# Altium project higgs.PrjPCB (part 4 of 7)

## Sheet tie-il34-il07.SchDoc: CS - Net Tie 34:07
size Letter; CheckedBy: J. Brinton; CompanyName: Signal Laboratories, Inc.; DrawnBy: J. Brinton; Engineer: J. Brinton; Address1: 3479 Edison Way; Address2: Menlo Park CA 94025; Address3: +1 (877) 778-8435; Address4: siglabs.com; Revision: 3; SheetNumber: 28; SheetTotal: 47
Used 4 times, as channels MAIN/ARRAY/TIE-IL34_20-IL07_30, MAIN/ARRAY/TIE-IL34_21-IL07_31, MAIN/ARRAY/TIE-IL34_22-IL07_32, MAIN/ARRAY/TIE-IL34_23-IL07_33. Parts and nets are listed once, with the designators drawn on the sheet.
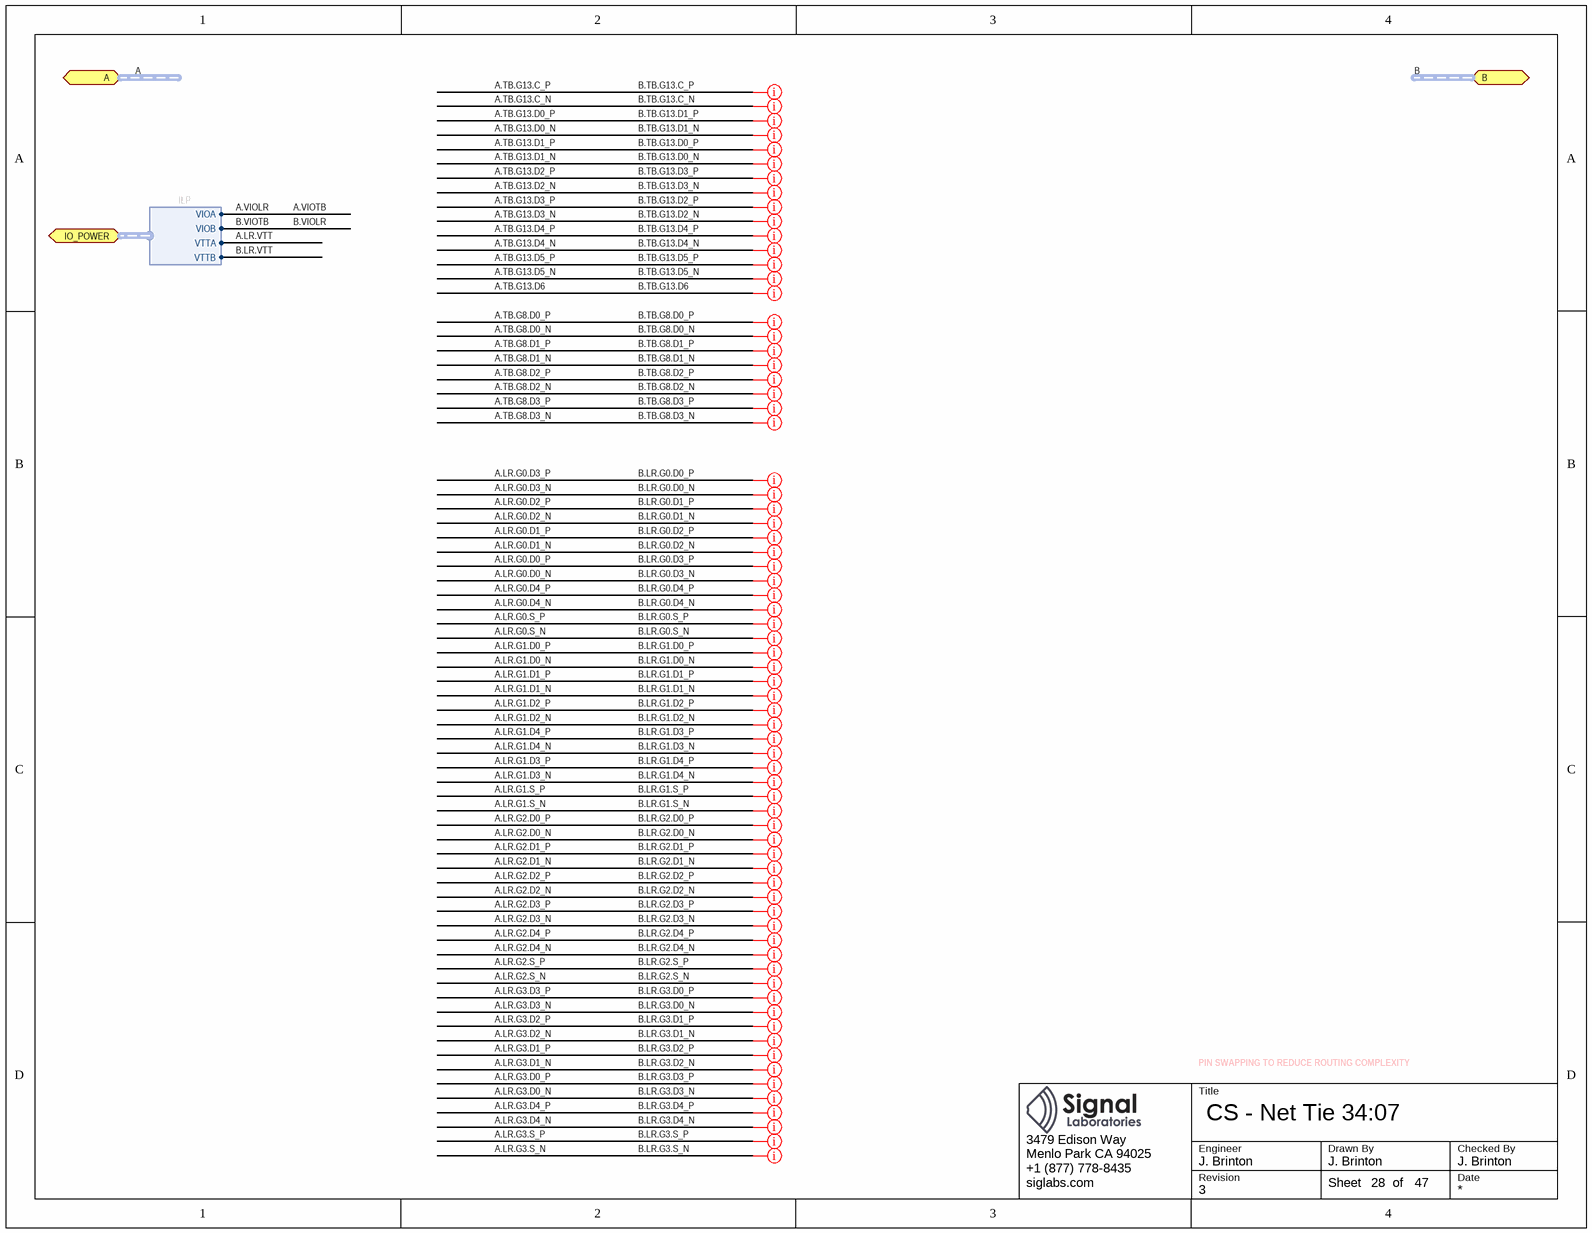
[diagram p19: tie-il34-il07.SchDoc]

### Ports
A (harness IL), B (harness IL), IO_POWER (harness ILP)

### Harnesses
ILP: VIOA, VIOB, VTTA, VTTB

### Channels
MAIN/ARRAY/TIE-IL34_20-IL07_30: no parts or ports
MAIN/ARRAY/TIE-IL34_21-IL07_31: no parts or ports
MAIN/ARRAY/TIE-IL34_22-IL07_32: no parts or ports
MAIN/ARRAY/TIE-IL34_23-IL07_33: no parts or ports

### Buses and harness runs
harness A = port A
harness B = port B

### Layout directives
net class z50: A.TB.G13.D6_TIE-IL34_20-IL07_30
net class z50; differential pair; net class loose: A.LR.G0.D0_N_TIE-IL34_20-IL07_30, A.LR.G0.D0_P_TIE-IL34_20-IL07_30, A.LR.G0.D1_N_TIE-IL34_20-IL07_30, A.LR.G0.D1_P_TIE-IL34_20-IL07_30, A.LR.G0.D2_N_TIE-IL34_20-IL07_30, A.LR.G0.D2_P_TIE-IL34_20-IL07_30, A.LR.G0.D3_N_TIE-IL34_20-IL07_30, A.LR.G0.D3_P_TIE-IL34_20-IL07_30, A.LR.G0.D4_N_TIE-IL34_20-IL07_30, A.LR.G0.D4_P_TIE-IL34_20-IL07_30, A.LR.G0.S_N_TIE-IL34_20-IL07_30, A.LR.G0.S_P_TIE-IL34_20-IL07_30, A.LR.G1.D0_N_TIE-IL34_20-IL07_30, A.LR.G1.D0_P_TIE-IL34_20-IL07_30, A.LR.G1.D1_N_TIE-IL34_20-IL07_30, A.LR.G1.D1_P_TIE-IL34_20-IL07_30, A.LR.G1.D2_N_TIE-IL34_20-IL07_30, A.LR.G1.D2_P_TIE-IL34_20-IL07_30, A.LR.G1.D3_N_TIE-IL34_20-IL07_30, A.LR.G1.D3_P_TIE-IL34_20-IL07_30, A.LR.G1.D4_N_TIE-IL34_20-IL07_30, A.LR.G1.D4_P_TIE-IL34_20-IL07_30, A.LR.G1.S_N_TIE-IL34_20-IL07_30, A.LR.G1.S_P_TIE-IL34_20-IL07_30, A.LR.G2.D0_N_TIE-IL34_20-IL07_30, A.LR.G2.D0_P_TIE-IL34_20-IL07_30, A.LR.G2.D1_N_TIE-IL34_20-IL07_30, A.LR.G2.D1_P_TIE-IL34_20-IL07_30, A.LR.G2.D2_N_TIE-IL34_20-IL07_30, A.LR.G2.D2_P_TIE-IL34_20-IL07_30, A.LR.G2.D3_N_TIE-IL34_20-IL07_30, A.LR.G2.D3_P_TIE-IL34_20-IL07_30, A.LR.G2.D4_N_TIE-IL34_20-IL07_30, A.LR.G2.D4_P_TIE-IL34_20-IL07_30, A.LR.G2.S_N_TIE-IL34_20-IL07_30, A.LR.G2.S_P_TIE-IL34_20-IL07_30, A.LR.G3.D0_N_TIE-IL34_20-IL07_30, A.LR.G3.D0_P_TIE-IL34_20-IL07_30, A.LR.G3.D1_N_TIE-IL34_20-IL07_30, A.LR.G3.D1_P_TIE-IL34_20-IL07_30, A.LR.G3.D2_N_TIE-IL34_20-IL07_30, A.LR.G3.D2_P_TIE-IL34_20-IL07_30, A.LR.G3.D3_N_TIE-IL34_20-IL07_30, A.LR.G3.D3_P_TIE-IL34_20-IL07_30, A.LR.G3.D4_N_TIE-IL34_20-IL07_30, A.LR.G3.D4_P_TIE-IL34_20-IL07_30, A.LR.G3.S_N_TIE-IL34_20-IL07_30, A.LR.G3.S_P_TIE-IL34_20-IL07_30, A.TB.G8.D0_N_TIE-IL34_20-IL07_30, A.TB.G8.D0_P_TIE-IL34_20-IL07_30, A.TB.G8.D1_N_TIE-IL34_20-IL07_30, A.TB.G8.D1_P_TIE-IL34_20-IL07_30, A.TB.G8.D2_N_TIE-IL34_20-IL07_30, A.TB.G8.D2_P_TIE-IL34_20-IL07_30, A.TB.G8.D3_N_TIE-IL34_20-IL07_30, A.TB.G8.D3_P_TIE-IL34_20-IL07_30, A.TB.G13.C_N_TIE-IL34_20-IL07_30, A.TB.G13.C_P_TIE-IL34_20-IL07_30, A.TB.G13.D0_N_TIE-IL34_20-IL07_30, A.TB.G13.D0_P_TIE-IL34_20-IL07_30, A.TB.G13.D1_N_TIE-IL34_20-IL07_30, A.TB.G13.D1_P_TIE-IL34_20-IL07_30, A.TB.G13.D2_N_TIE-IL34_20-IL07_30, A.TB.G13.D2_P_TIE-IL34_20-IL07_30, A.TB.G13.D3_N_TIE-IL34_20-IL07_30, A.TB.G13.D3_P_TIE-IL34_20-IL07_30, A.TB.G13.D4_N_TIE-IL34_20-IL07_30, A.TB.G13.D4_P_TIE-IL34_20-IL07_30, A.TB.G13.D5_N_TIE-IL34_20-IL07_30, A.TB.G13.D5_P_TIE-IL34_20-IL07_30

### Notes on the sheet
- PIN SWAPPING TO REDUCE ROUTING COMPLEXITY
- Title
- Engineer
- Revision
- Drawn By
- Checked By
- Date
- Sheet
- of

## Sheet clock.SchDoc: CS - Clock Fanout
size Letter; CheckedBy: J. Brinton; CompanyName: Signal Laboratories, Inc.; DrawnBy: J. Brinton; Engineer: J. Brinton; Address1: 3479 Edison Way; Address2: Menlo Park CA 94025; Address3: +1 (877) 778-8435; Address4: siglabs.com; Revision: 3; SheetNumber: 37; SheetTotal: 47
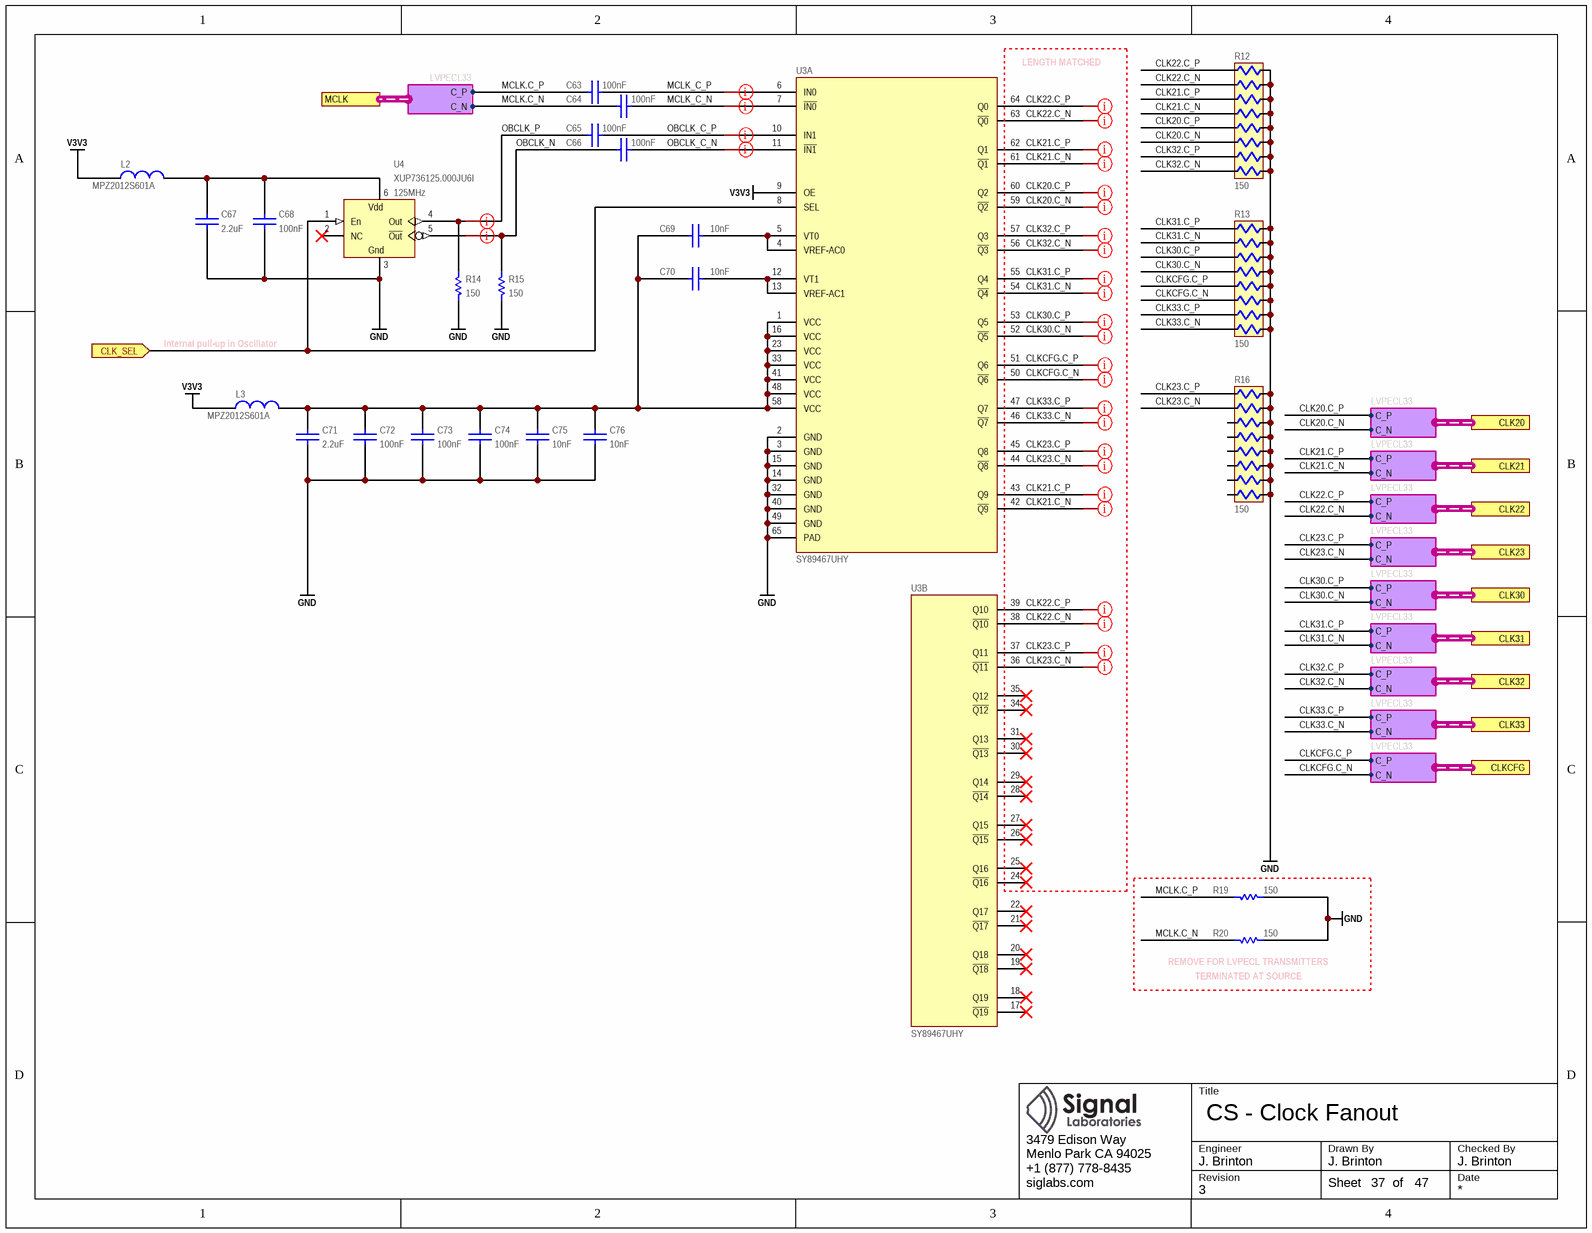
[diagram p20: clock.SchDoc]

### Parts
C63  value 100nF  [CAPC100X50X55L25N]  (hidden comment: GCM155R71H104KE02)
C64  value 100nF  [CAPC100X50X55L25N]  (hidden comment: GCM155R71H104KE02)
C65  value 100nF  [CAPC100X50X55L25N]  (hidden comment: GCM155R71H104KE02)
C66  value 100nF  [CAPC100X50X55L25N]  (hidden comment: GCM155R71H104KE02)
C67  value 2.2uF  [CAPC160X80X90L20N]  (hidden comment: C1608X7R1A225M080)
C68  value 100nF  [CAPC100X50X55L25N]  (hidden comment: GCM155R71H104KE02)
C69  value 10nF  [CAPC100X50X55L25N]  (hidden comment: GRM155R71H103KA88)
C70  value 10nF  [CAPC100X50X55L25N]  (hidden comment: GRM155R71H103KA88)
C71  value 2.2uF  [CAPC160X80X90L20N]  (hidden comment: C1608X7R1A225M080)
C72  value 100nF  [CAPC100X50X55L25N]  (hidden comment: GCM155R71H104KE02)
C73  value 100nF  [CAPC100X50X55L25N]  (hidden comment: GCM155R71H104KE02)
C74  value 100nF  [CAPC100X50X55L25N]  (hidden comment: GCM155R71H104KE02)
C75  value 10nF  [CAPC100X50X55L25N]  (hidden comment: GRM155R71H103KA88)
C76  value 10nF  [CAPC100X50X55L25N]  (hidden comment: GRM155R71H103KA88)
L2  MPZ2012S601A  [0805]
L3  MPZ2012S601A  [0805]
R12  value 150  [RESCAXE16P50_380X160X55L30X35N]  (hidden comment: EXB-2HV151JV)
R13  value 150  [RESCAXE16P50_380X160X55L30X35N]  (hidden comment: EXB-2HV151JV)
R14  value 150  [RESC1005X40N]  (hidden comment: ERJ-2RKF1500X)
R15  value 150  [RESC1005X40N]  (hidden comment: ERJ-2RKF1500X)
R16  value 150  [RESCAXE16P50_380X160X55L30X35N]  (hidden comment: EXB-2HV151JV)
R19  value 150  [RESC1005X40N]  (hidden comment: ERJ-2RKF1500X)
R20  value 150  [RESC1005X40N]  (hidden comment: ERJ-2RKF1500X)
U3  SY89467UHY  [QFP65P50_1200X1200X120L60X22T500N]  (parts A,B of 2)
U4  value 125MHz  [OSCSC6P254_735X505X140L110X140]  (hidden comment: XUP736125.000JU6I)

### Ports
CLK20 (harness LVPECL33), CLK21 (harness LVPECL33), CLK22 (harness LVPECL33), CLK23 (harness LVPECL33), CLK30 (harness LVPECL33), CLK31 (harness LVPECL33), CLK32 (harness LVPECL33), CLK33 (harness LVPECL33), CLK_SEL (in), CLKCFG (harness LVPECL33), MCLK (harness LVPECL33)

### Harnesses
LVPECL33: C_P, C_N

### Nets
GND: C67.1 C68.1 C71.1 C72.1 C73.1 C74.1 C75.2 C76.2 R12.9 R12.10 R12.11 R12.12 R12.13 R12.14 R12.15 R12.16 R13.9 R13.10 R13.11 R13.12 R13.13 R13.14 R13.15 R13.16 R14.1 R15.1 R16.9 R16.10 R16.11 R16.12 R16.13 R16.14 R16.15 R16.16 R19.2 R20.2 U3.2(GND) U3.3(GND) U3.14(GND) U3.15(GND) U3.32(GND) U3.40(GND) U3.49(GND) U3.65(PAD) U4.3(GND)
V3V3: L2.2 L3.2 U3.9(OE)
CLK20.C_N: R12.6 U3.59(~{Q2}) ; port CLK20.C_N  [project net CLK.C_N]
CLK20.C_P: R12.5 U3.60(Q2) ; port CLK20.C_P  [project net CLK.C_P]
CLK21.C_N: R12.4 U3.42(~{Q9}) U3.61(~{Q1}) ; port CLK21.C_N  [project net CLK.C_N]
CLK21.C_P: R12.3 U3.43(Q9) U3.62(Q1) ; port CLK21.C_P  [project net CLK.C_P]
CLK22.C_N: R12.2 U3.38(~{Q10}) U3.63(~{Q0}) ; port CLK22.C_N  [project net CLK.C_N]
CLK22.C_P: R12.1 U3.39(Q10) U3.64(Q0) ; port CLK22.C_P  [project net CLK.C_P]
CLK23.C_N: R16.2 U3.36(~{Q11}) U3.44(~{Q8}) ; port CLK23.C_N  [project net CLK.C_N]
CLK23.C_P: R16.1 U3.37(Q11) U3.45(Q8) ; port CLK23.C_P  [project net CLK.C_P]
CLK30.C_N: R13.4 U3.52(~{Q5}) ; port CLK30.C_N  [project net CLK.C_N]
CLK30.C_P: R13.3 U3.53(Q5) ; port CLK30.C_P  [project net CLK.C_P]
CLK31.C_N: R13.2 U3.54(~{Q4}) ; port CLK31.C_N  [project net CLK.C_N]
CLK31.C_P: R13.1 U3.55(Q4) ; port CLK31.C_P  [project net CLK.C_P]
CLK32.C_N: R12.8 U3.56(~{Q3}) ; port CLK32.C_N  [project net CLK.C_N]
CLK32.C_P: R12.7 U3.57(Q3) ; port CLK32.C_P  [project net CLK.C_P]
CLK33.C_N: R13.8 U3.46(~{Q7}) ; port CLK33.C_N  [project net CLK.C_N]
CLK33.C_P: R13.7 U3.47(Q7) ; port CLK33.C_P  [project net CLK.C_P]
CLK_SEL: U3.8(SEL) U4.1(En) ; port CLK_SEL
CLKCFG.C_N: R13.6 U3.50(~{Q6}) ; port CLKCFG.C_N
CLKCFG.C_P: R13.5 U3.51(Q6) ; port CLKCFG.C_P
MCLK.C_N: C64.2 R20.1 ; port MCLK.C_N
MCLK.C_P: C63.2 R19.1 ; port MCLK.C_P
MCLK_C_N: C64.1 U3.7(~{IN0})
MCLK_C_P: C63.1 U3.6(IN0)
OBCLK_C_N: C66.1 U3.11(~{IN1})
OBCLK_C_P: C65.1 U3.10(IN1)
OBCLK_N: C66.2 R15.2 U4.5(~{Out})
OBCLK_P: C65.2 R14.2 U4.4(Out)
NetC67_2: C67.2 C68.2 L2.1 U4.6(Vdd)
NetC69_1: C69.1 C70.1 C71.2 C72.2 C73.2 C74.2 C75.1 C76.1 L3.1 U3.1(VCC) U3.16(VCC) U3.23(VCC) U3.33(VCC) U3.41(VCC) U3.48(VCC) U3.58(VCC)
NetC69_2: C69.2 U3.4(VREF-AC0) U3.5(VT0)
NetC70_2: C70.2 U3.12(VT1) U3.13(VREF-AC1)

Not connected (* = marked no-connect by the designer): R16 3 4 5 6 7 8; U3 17(~{Q19})* 18(Q19)* 19(~{Q18})* 20(Q18)* 21(~{Q17})* 22(Q17)* 24(~{Q16})* 25(Q16)* 26(~{Q15})* 27(Q15)* 28(~{Q14})* 29(Q14)* 30(~{Q13})* 31(Q13)* 34(~{Q12})* 35(Q12)*; U4 2(NC)*

### Layout directives
net class z50; differential pair; net class tight; net class clks: CLK.C_N, CLK.C_P, CLKCFG.C_N, CLKCFG.C_P, MCLK_C_N, MCLK_C_P, OBCLK_C_N, OBCLK_C_P, OBCLK_N, OBCLK_P

### Notes on the sheet
- (near U3) LENGTH MATCHED
- Internal pull-up in Oscillator
- (near R20) REMOVE FOR LVPECL TRANSMITTERS
- (near R20) TERMINATED AT SOURCE
- Title
- Engineer
- Revision
- Drawn By
- Checked By
- Date
- Sheet
- of
- (in symbol EG-2121CA 100.0000M-PHPAB) Gnd

### Library data of the parts
C63-C66 C68 C72-C74 = CAP: Ceramic Capacitor 100nF ±10% 50V X7R 0402; Manufacturer: Murata; Tr: -55:125; Manufacturer P/N: GCM155R71H104KE02; Tolerance: ±10%; Voltage: 50V; Footprint: *; Package: 0402
C67 C71 = CAP: Ceramic Capacitor 2.2uF ±20% 10V X7R 0603; Manufacturer: TDK; Tr: -55:125; Manufacturer P/N: C1608X7R1A225M080; Tolerance: ±20%; Voltage: 10V; Footprint: *; Package: 0603
C69 C70 C75 C76 = CAP: Ceramic Capacitor 10nF ±10% 50V X7R 0402; Manufacturer: Murata; Tr: -55:125; Manufacturer P/N: GRM155R71H103KA88; Tolerance: ±10%; Voltage: 50V; Package: 0402
L2 L3 = INDUCTANCE1: Ferrite Bead 600-Ohm @ 100 MHz 2A 0805; Manufacturer: TDK; Manufacturer P/N: MPZ2012S601A
R12 R13 R16 = EXB-2HV470JV: 8 Resistor Array 150 ±5% 0.0625W 25V 1506; Manufacturer: Panasonic; Tr: -55:125; Manufacturer P/N: EXB-2HV151JV; Package: 1506; Tolerance: ±5%
R14 R15 R19 R20 = RES: Thick Film Resistor 150 ±1% 0.1W 50V 0402; Manufacturer: Panasonic; Tcr: ±100; Tr: -55:155; Voltage: 50; Power: 0.1; Tolerance: ±1%; Manufacturer P/N: ERJ-2RKF1500X; Alternatives: *; Footprint: *; Package: 0402
  R19 R20: Do Not Place: *
U3 = SY89467UHY: 2:20 LVPECL Clock Distribution Driver; Manufacturer: Microchip; Manufacturer P/N: SY89467UHY
U4 = EG-2121CA 100.0000M-PHPAB: Oscillator 100MHz LPECL 3.3V 25ppm SMD; Manufacturer: IDT; Manufacturer P/N: XUP736125.000JU6I

## Sheet reset.SchDoc: CS - Reset
size Letter; CheckedBy: J. Brinton; CompanyName: Signal Laboratories, Inc.; DrawnBy: J. Brinton; Engineer: J. Brinton; Address1: 3479 Edison Way; Address2: Menlo Park CA 94025; Address3: +1 (877) 778-8435; Address4: siglabs.com; Revision: 3; SheetNumber: 38; SheetTotal: 47
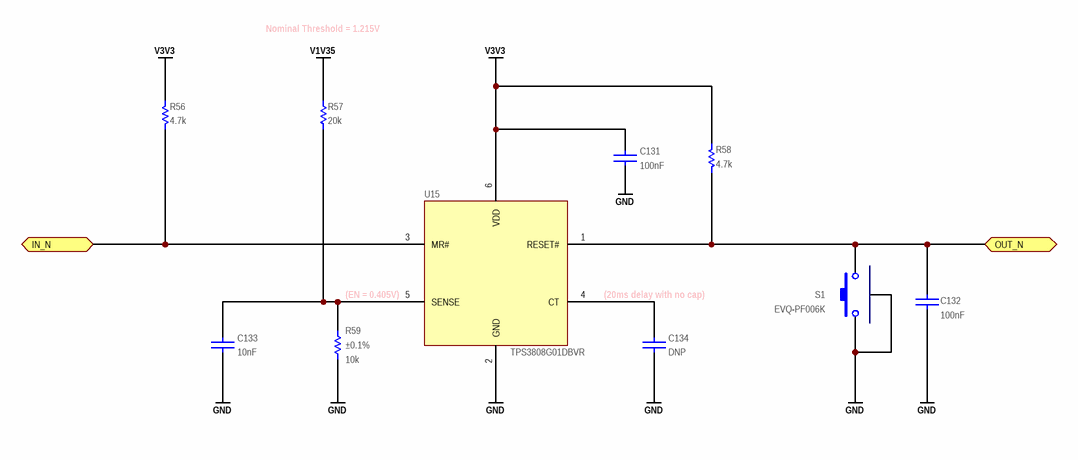
[diagram p21: reset.SchDoc]

### Parts
C131  value 100nF  [CAPC100X50X55L25N]  (hidden comment: GCM155R71H104KE02)
C132  value 100nF  [CAPC100X50X55L25N]  (hidden comment: GCM155R71H104KE02)
C133  value 10nF  [CAPC100X50X55L25N]  (hidden comment: GRM155R71H103KA88)
C134  Do Not Place: DNP  [CAPC200X125X145L45N]  (hidden comment: CAP 0805)
R56  value 4.7k  [RESC1005X40N]  (hidden comment: ERJ-2RKF4701X)
R57  value 20k  [RESC2012X70N]  (hidden comment: ERA-6AEB203V)
R58  value 4.7k  [RESC1005X40N]  (hidden comment: ERJ-2RKF4701X)
R59  value 10k  Tolerance: ±0.1%  [RESC2012X70N]  (hidden comment: ERA-6AEB103V)
S1  EVQ-PF006K  [EVQ-PF006K]
U15  TPS3808G01DBVR  [DBV-6]

### Ports
IN_N (bidir), OUT_N (bidir)

### Nets
GND: C131.2 C132.1 C133.2 C134.2 R59.1 S1.1 S1.3 U15.2(GND)
V1V35: R57.2
V3V3: C131.1 R56.2 R58.2 U15.6(VDD)
FPGA_PROG_N: R56.1 U15.3(MR#) ; port IN_N
PROG_N: C132.2 R58.1 S1.2 U15.1(RESET#) ; port OUT_N
NetC133_1: C133.1 R57.1 R59.2 U15.5(SENSE)
NetC134_1: C134.1 U15.4(CT)

### Notes on the sheet
- Nominal Threshold = 1.215V
- (near U15) (EN = 0.405V)
- (20ms delay with no cap)
- Title
- Engineer
- Revision
- Drawn By
- Checked By
- Date
- Sheet
- of

### Library data of the parts
C131 C132 = CAP: as C63-C66 on sheet clock; Manufacturer P/N: GCM155R71H104KE02; Tolerance: ±10%; Voltage: 50V; Package: 0402
  C132: Footprint: *
C133 = CAP: as C69 on sheet clock; Manufacturer P/N: GRM155R71H103KA88; Tolerance: ±10%; Voltage: 50V; Package: 0402
C134 = CAP: Capacitor 0805; Manufacturer: *; Manufacturer P/N: *; Tolerance: *; Voltage: *; Tr: *; Package: 0805
R56 R58 = RES: Thick Film Resistor 4.7k ±1% 0.1W 75V 0402; Manufacturer: Panasonic; Tcr: ±100; Tr: -55:155; Voltage: 75; Power: 0.1; Tolerance: ±1%; Manufacturer P/N: ERJ-2RKF4701X; Alternatives: *; Footprint: *; Package: 0402
R57 = RES: Thin Film Resistor 20k ±0.1% 0.125W 100V 0805; Manufacturer: Panasonic; Tcr: ±25; Tr: -55:155; Voltage: 100; Power: 0.125; Tolerance: ±0.1%; Manufacturer P/N: ERA-6AEB203V; Alternatives: *; Footprint: *; Package: 0805
R59 = RES: Thin Film Resistor 10k ±0.1% 0.125W 100V 0805; Manufacturer: Panasonic; Tcr: ±25; Tr: -55:155; Voltage: 100; Power: 0.125; Manufacturer P/N: ERA-6AEB103V; Package: 0805
S1 = EVQ-PF006K: Tactile Switch; Normally Open; Manufacturer: Panasonic; Manufacturer P/N: EVQ-PF006K
U15 = TPS3808: Low Quiescent Current, Programmable-Delay  Supervisory Circuit; Manufacturer: Texas Instruments; Manufacturer P/N: TPS3808G01DBVR

## Sheet tie-mib-imib.SchDoc: CS - Net Tie IMIB
size Letter; CheckedBy: J. Brinton; CompanyName: Signal Laboratories, Inc.; DrawnBy: J. Brinton; Engineer: J. Brinton; Address1: 3479 Edison Way; Address2: Menlo Park CA 94025; Address3: +1 (877) 778-8435; Address4: siglabs.com; Revision: 3; SheetNumber: 30; SheetTotal: 47
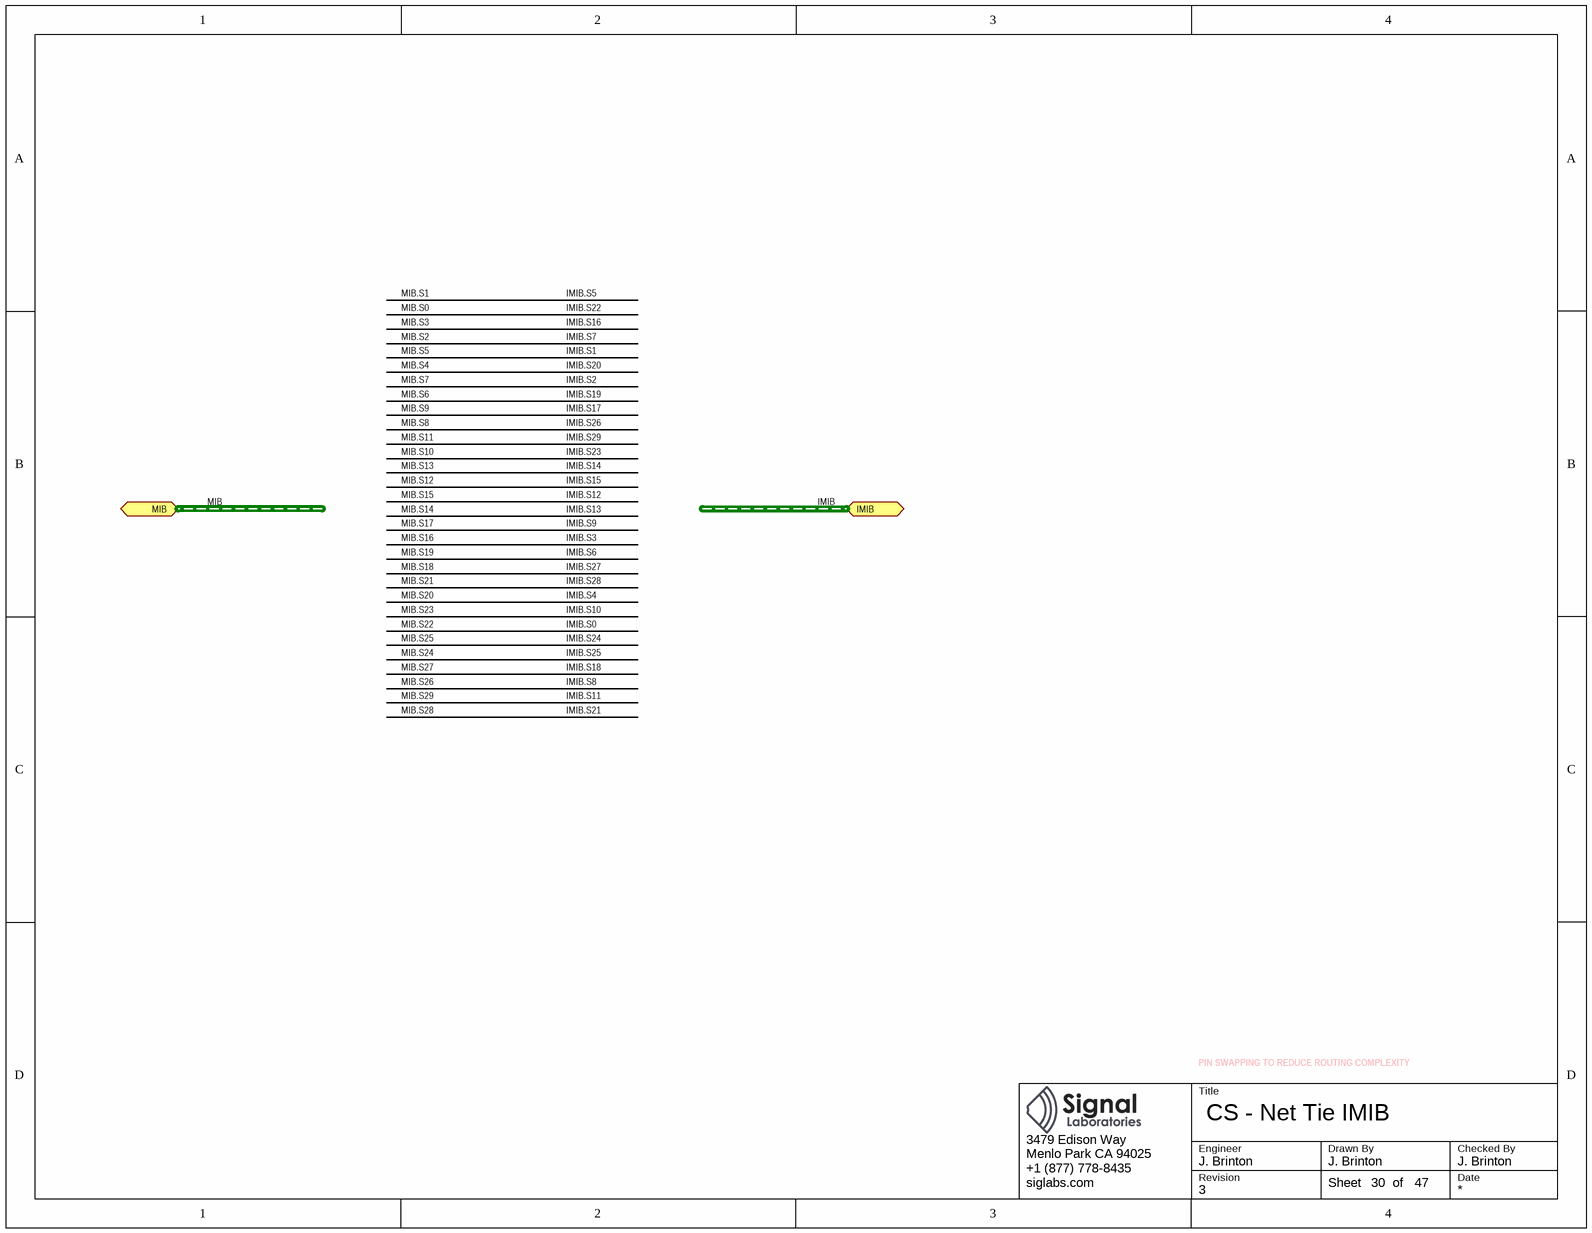
[diagram p22: tie-mib-imib.SchDoc]

### Ports
IMIB (harness MIB), MIB (harness MIB)

### Buses and harness runs
harness IMIB = port IMIB
harness MIB = port MIB

### Notes on the sheet
- PIN SWAPPING TO REDUCE ROUTING COMPLEXITY
- Title
- Engineer
- Revision
- Drawn By
- Checked By
- Date
- Sheet
- of

## Sheet power-v3v3.SchDoc: CS - Power 3.3V
size Letter; CheckedBy: J. Brinton; CompanyName: Signal Laboratories, Inc.; DrawnBy: J. Brinton; Engineer: J. Brinton; Address1: 3479 Edison Way; Address2: Menlo Park CA 94025; Address3: +1 (877) 778-8435; Address4: siglabs.com; Revision: 3; SheetNumber: 41; SheetTotal: 47
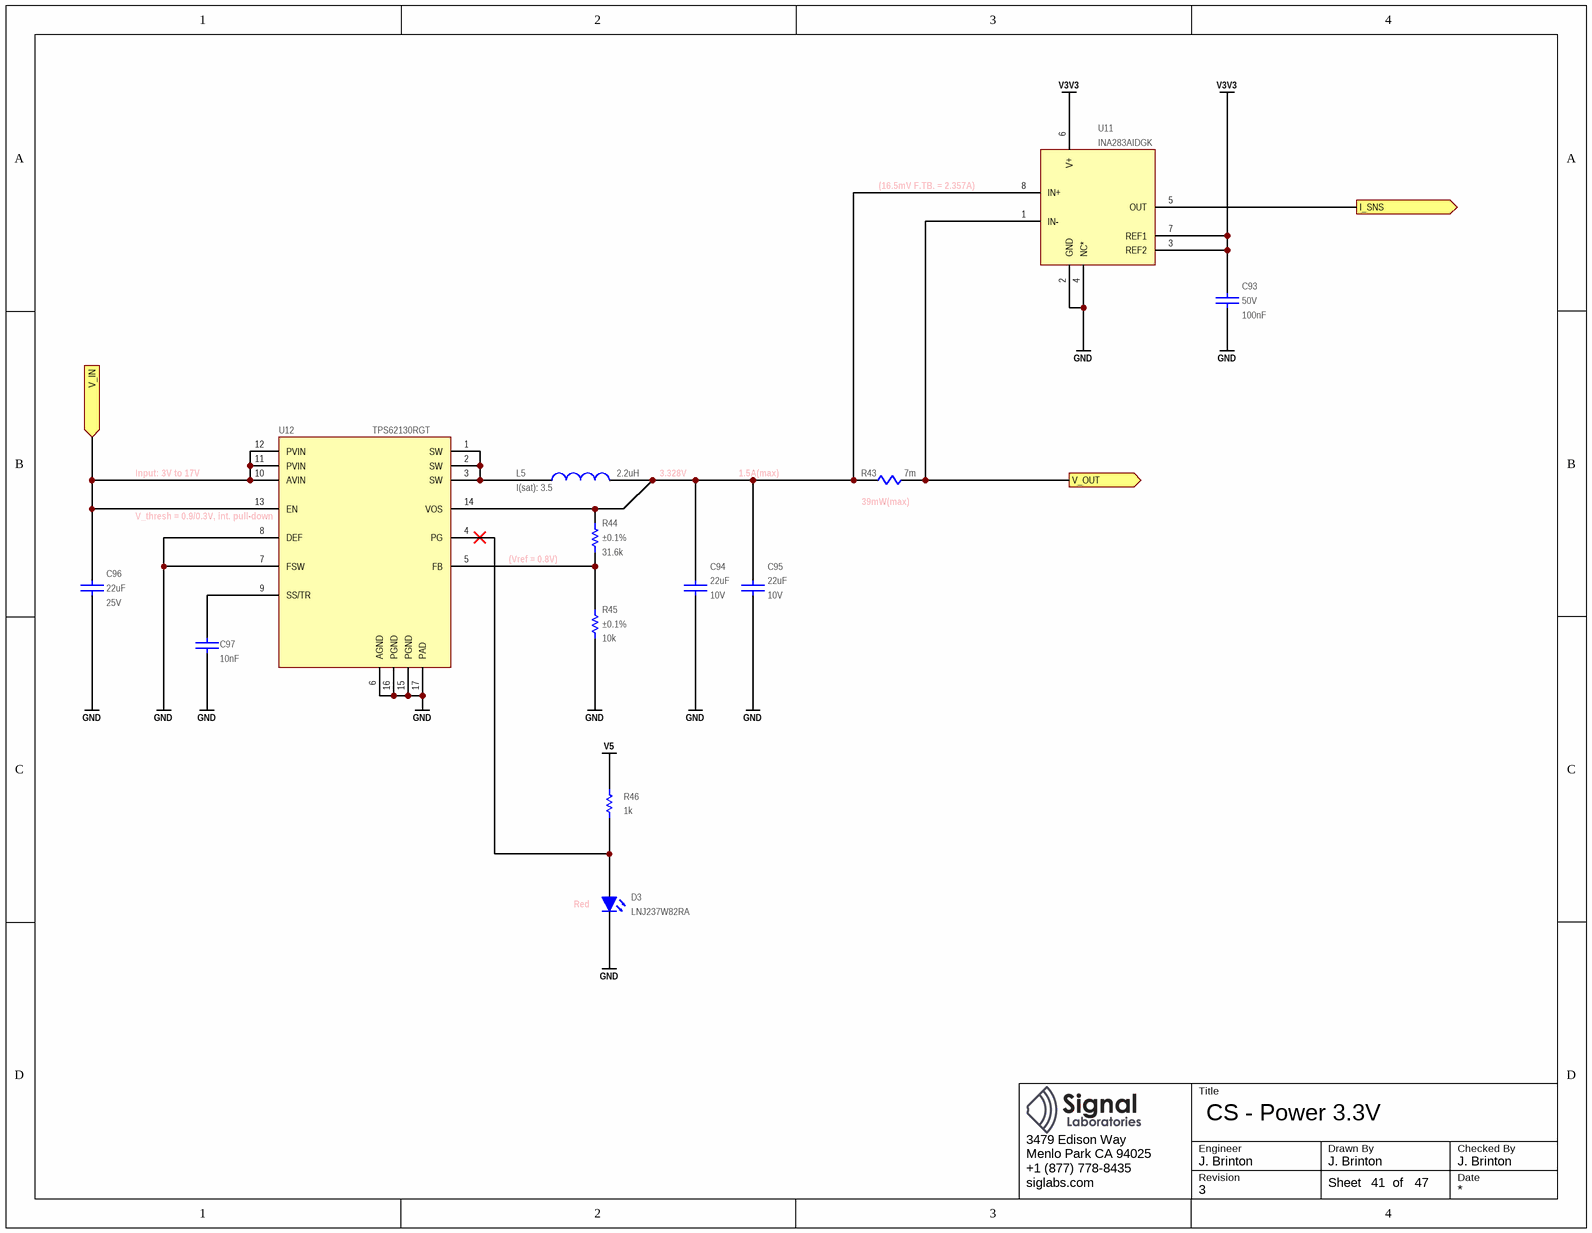
[diagram p23: power-v3v3.SchDoc]

### Parts
C93  value 100nF  Voltage: 50V  [CAPC100X50X55L25N]  (hidden comment: GCM155R71H104KE02)
C94  value 22uF  Voltage: 10V  [CAPC200X125X145L45N]  (hidden comment: C2012X7S1A226M125)
C95  value 22uF  Voltage: 10V  [CAPC200X125X145L45N]  (hidden comment: C2012X7S1A226M125)
C96  value 22uF  Voltage: 25V  [CAPC320X250X270L50N]  (hidden comment: GRM32ER71E226KE15)
C97  value 10nF  [CAPC100X50X55L25N]  (hidden comment: GRM155R71H103KA88)
D3  LNJ237W82RA  [0603_LED]
L5  value 2.2uH  I(sat): 3.5  [XFL4020]  (hidden comment: XFL4020-222ME)
R43  value 7m  [RESC3216X80L110N]  (hidden comment: CSR1206-0R007F1)
R44  value 31.6k  Tolerance: ±0.1%  [RESC2012X70N]  (hidden comment: ERA-6AEB3162V)
R45  value 10k  Tolerance: ±0.1%  [RESC2012X70N]  (hidden comment: ERA-6AEB103V)
R46  value 1k  [RESC1005X40N]  (hidden comment: ERJ-2RKF1001X)
U11  INA283AIDGK  [S-PDSO-G8]
U12  TPS62130RGT  [S-PQFP-8N]

### Ports
I_SNS (out), V_IN (in), V_OUT (out)

### Nets
GND: C93.1 C94.1 C95.1 C96.1 C97.2 D3.2(K) R45.1 U11.2(GND) U11.4(NC*) U12.6(AGND) U12.7(FSW) U12.8(DEF) U12.15(PGND) U12.16(PGND) U12.17(PAD)
V3V3: C93.2 R43.2 U11.1(IN-) U11.3(REF2) U11.6(V+) U11.7(REF1) ; port V_OUT
V5: R46.2
V12: C96.2 U12.10(AVIN) U12.11(PVIN) U12.12(PVIN) U12.13(EN) ; port V_IN
I3V3_SNS: U11.5(OUT) ; port I_SNS
NetC94_2: C94.2 C95.2 L5.2 R43.1 R44.2 U11.8(IN+) U12.14(VOS)
NetC97_1: C97.1 U12.9(SS/TR)
NetD3_1: D3.1(A) R46.1 U12.4(PG)
NetL5_1: L5.1 U12.1(SW) U12.2(SW) U12.3(SW)
NetR44_1: R44.1 R45.2 U12.5(FB)

### Notes on the sheet
- (16.5mV F.TB. = 2.357A)
- Input: 3V to 17V
- (near U12) V_thresh = 0.9/0.3V, int. pull-down
- 3.328V
- 1.5A(max)
- (near R43) 39mW(max)
- (near R44) (Vref = 0.8V)
- (near D3) Red
- Title
- Engineer
- Revision
- Drawn By
- Checked By
- Date
- Sheet
- of

### Library data of the parts
C93 = CAP: as C63-C66 on sheet clock; Manufacturer P/N: GCM155R71H104KE02; Tolerance: ±10%; Package: 0402
C94 C95 = CAP: Ceramic Capacitor 22uF ±20% 10V X7S 0805; Manufacturer: TDK; Tr: -55:125; Manufacturer P/N: C2012X7S1A226M125; Tolerance: ±20%; Package: 0805
C96 = CAP: Ceramic Capacitor 22uF ±10% 25V X7R 1210; Manufacturer: Murata; Tr: -55:125; Manufacturer P/N: GRM32ER71E226KE15; Tolerance: ±10%; Package: 1210
C97 = CAP: as C69 on sheet clock; Manufacturer P/N: GRM155R71H103KA88; Tolerance: ±10%; Voltage: 50V; Package: 0402
D3 = LED0603RD: LED, SMT 0603, Color Red, 5mA, 1.85V; Manufacturer: Panasonic; Do Not Place: DNP; Manufacturer P/N: LNJ237W82RA; Package: 0603 Polarized
L5 = COIL: Wirewound Inductor 2.2uH +/-20% 3.5A SMD; Manufacturer: Coilcraft; Manufacturer P/N: XFL4020-222ME
R43 = CSR1206-0R001F1: Current Sense Resistor 7mOhm +/-1% SMD 1206; Manufacturer: Riedon; Manufacturer P/N: CSR1206-0R007F1; Package: 1206
R44 = RES: Thin Film Resistor 31.6k ±0.1% 0.125W 100V 0805; Manufacturer: Panasonic; Tcr: ±25; Tr: -55:155; Voltage: 100; Power: 0.125; Manufacturer P/N: ERA-6AEB3162V; Package: 0805
R45 = RES: as R59 on sheet reset; Manufacturer P/N: ERA-6AEB103V; Package: 0805
R46 = RES: Thick Film Resistor 1k ±1% 0.1W 50V 0402; Manufacturer: Panasonic; Tcr: ±100; Tr: -55:155; Voltage: 50; Power: 0.1; Do Not Place: DNP; Manufacturer P/N: ERJ-2RKF1001X; Tolerance: ±1%; Alternatives: *; Footprint: *; Package: 0402
U11 = INA283AIDGK: Bidirectional Current Shunt Monitor; Manufacturer: Texas Instruments; Manufacturer P/N: INA283AIDGK
U12 = TPS62130RGT: 3-17V 3A Step-Down Converter VQFN; Manufacturer: Texas Instruments; Manufacturer P/N: TPS62130RGT

## Sheet power-v1v35.SchDoc: CS - Power 1.35V
size Letter; CheckedBy: J. Brinton; CompanyName: Signal Laboratories, Inc.; DrawnBy: J. Brinton; Engineer: J. Brinton; Address1: 3479 Edison Way; Address2: Menlo Park CA 94025; Address3: +1 (877) 778-8435; Address4: siglabs.com; Revision: 3; SheetNumber: 44; SheetTotal: 47
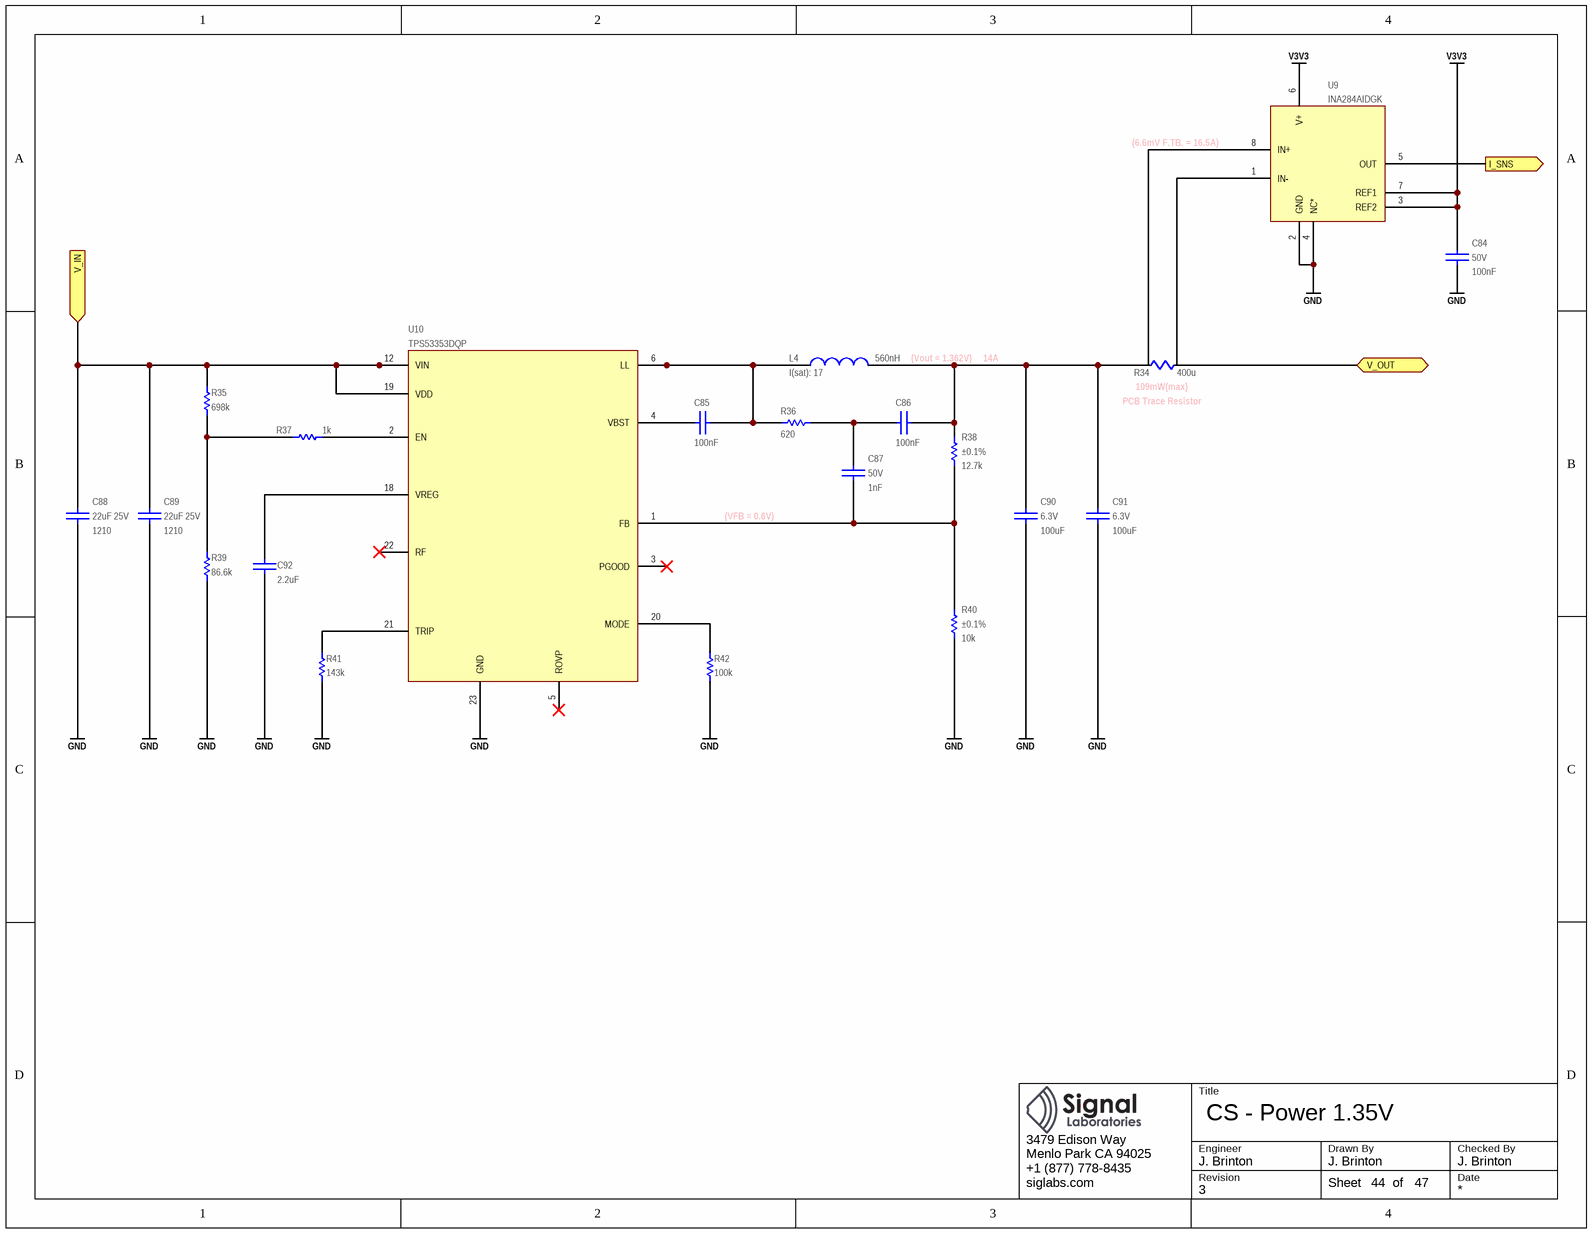
[diagram p24: power-v1v35.SchDoc]

### Parts
C84  value 100nF  Voltage: 50V  [CAPC100X50X55L25N]  (hidden comment: GCM155R71H104KE02)
C85  value 100nF  [CAPC100X50X55L25N]  (hidden comment: GCM155R71H104KE02)
C86  value 100nF  [CAPC100X50X55L25N]  (hidden comment: GCM155R71H104KE02)
C87  value 1nF  Voltage: 50V  [CAPC100X50X55L25N]  (hidden comment: GRM155R71H102KA01)
C88  value 22uF  Voltage: 25V  Package: 1210  [CAPC320X250X270L50N]  (hidden comment: GRM32ER71E226KE15)
C89  value 22uF  Voltage: 25V  Package: 1210  [CAPC320X250X270L50N]  (hidden comment: GRM32ER71E226KE15)
C90  value 100uF  Voltage: 6.3V  [CAPC320X250X280L50N]  (hidden comment: C3225X6S0J107M250)
C91  value 100uF  Voltage: 6.3V  [CAPC320X250X280L50N]  (hidden comment: C3225X6S0J107M250)
C92  value 2.2uF  [CAPC160X80X90L20N]  (hidden comment: C1608X7R1A225M080)
L4  value 560nH  I(sat): 17  [XAL6030]  (hidden comment: XAL6030-561ME)
R34  value 400u  [RES0.0004]  (hidden comment: RES0.0004)  (net tie, no BOM)
R35  value 698k  [RESC1005X40N]  (hidden comment: ERJ-2RKF6983X)
R36  value 620  [RESC1005X40N]  (hidden comment: ERJ-2RKF6200X)
R37  value 1k  [RESC1005X40N]  (hidden comment: ERJ-2RKF1001X)
R38  value 12.7k  Tolerance: ±0.1%  [RESC2012X70N]  (hidden comment: ERA-6AEB1272V)
R39  value 86.6k  [RESC1005X40N]  (hidden comment: ERJ-2RKF8662X)
R40  value 10k  Tolerance: ±0.1%  [RESC2012X70N]  (hidden comment: ERA-6AEB103V)
R41  value 143k  [RESC1005X40N]  (hidden comment: ERJ-2RKF1433X)
R42  value 100k  [RESC1005X40N]  (hidden comment: ERJ-2RKF1003X)
U9  INA284AIDGK  [S-PDSO-G8]
U10  TPS53353DQP  [DQP]

### Ports
I_SNS (out), V_IN (in), V_OUT

### Nets
GND: C84.1 C88.1 C89.1 C90.2 C91.2 C92.1 R39.2 R40.1 R41.2 R42.2 U9.2(GND) U9.4(NC*) U10.23(GND)
V1V35: R34.2 ; port V_OUT
V3V3: C84.2 U9.3(REF2) U9.6(V+) U9.7(REF1)
V12: C88.2 C89.2 R35.1 U10.12(VIN) U10.13(VIN) U10.14(VIN) U10.15(VIN) U10.16(VIN) U10.17(VIN) U10.19(VDD) ; port V_IN
I1V35_SNSB: U9.5(OUT) ; port I_SNS
NetC85_1: C85.1 L4.1 R36.2 U10.6(LL) U10.7(LL) U10.8(LL) U10.9(LL) U10.10(LL) U10.11(LL)
NetC85_2: C85.2 U10.4(VBST)
NetC86_1: C86.1 C90.1 C91.1 L4.2 R34.1 R38.2
NetC86_2: C86.2 C87.1 R36.1
NetC87_2: C87.2 R38.1 R40.2 U10.1(FB)
NetC92_2: C92.2 U10.18(VREG)
NetR34_3: R34.3 U9.8(IN+)
NetR34_4: R34.4 U9.1(IN-)
NetR35_2: R35.2 R37.1 R39.1
NetR37_2: R37.2 U10.2(EN)
NetR41_1: R41.1 U10.21(TRIP)
NetR42_1: R42.1 U10.20(MODE)

Not connected (* = marked no-connect by the designer): U10 3(PGOOD)* 5(ROVP)* 22(RF)*

### Notes on the sheet
- (near U9) (6.6mV F.TB. = 16.5A)
- (Vout = 1.362V)
- 14A
- (near R34) 109mW(max)
- (near R34) PCB Trace Resistor
- (VFB = 0.6V)
- Title
- Engineer
- Revision
- Drawn By
- Checked By
- Date
- Sheet
- of

### Library data of the parts
C84-C86 = CAP: as C63-C66 on sheet clock; Manufacturer P/N: GCM155R71H104KE02; Tolerance: ±10%; Package: 0402
  C85 C86: Voltage: 50V; Footprint: *
C87 = CAP: Ceramic Capacitor 1nF ±10% 50V X7R 0402; Manufacturer: Murata; Tr: -55:125; Manufacturer P/N: GRM155R71H102KA01; Tolerance: ±10%; Package: 0402
C88 C89 = CAP: as C96 on sheet power-v3v3; Manufacturer P/N: GRM32ER71E226KE15; Tolerance: ±10%
C90 C91 = CAP: Ceramic Capacitor 100uF ±20% 6.3V X6S 1210; Manufacturer: TDK; Tr: -55:105; Manufacturer P/N: C3225X6S0J107M250; Tolerance: ±20%; Package: 1210
C92 = CAP: as C67 on sheet clock; Manufacturer P/N: C1608X7R1A225M080; Tolerance: ±20%; Voltage: 10V; Footprint: *; Package: 0603
L4 = INDUCTOR: Shielded Power Inductor 560nH, 17A; Manufacturer: Coilcraft; Manufacturer P/N: XAL6030-561ME
R34 = RES0.0004: Current Sense Resistor 400uOhm TRACE; Manufacturer: *; Manufacturer P/N: *
R35 = RES: Thick Film Resistor 698k ±1% 0.1W 50V 0402; Manufacturer: Panasonic; Tcr: ±100; Tr: -55:155; Voltage: 50; Power: 0.1; Manufacturer P/N: ERJ-2RKF6983X; Tolerance: ±1%; Alternatives: *; Footprint: *; Package: 0402
R36 = RES: Thick Film Resistor 620 ±1% 0.1W 50V 0402; Manufacturer: Panasonic; Tcr: ±100; Tr: -55:155; Voltage: 50; Power: 0.1; Manufacturer P/N: ERJ-2RKF6200X; Tolerance: ±1%; Alternatives: *; Footprint: *; Package: 0402
R37 = RES: Thick Film Resistor 1k ±1% 0.1W 50V 0402; Manufacturer: Panasonic; Tcr: ±100; Tr: -55:155; Voltage: 50; Power: 0.1; Manufacturer P/N: ERJ-2RKF1001X; Tolerance: ±1%; Alternatives: *; Footprint: *; Package: 0402
R38 = RES: Thin Film Resistor 12.7k ±0.1% 0.125W 100V 0805; Manufacturer: Panasonic; Tcr: ±25; Tr: -55:155; Voltage: 100; Power: 0.125; Manufacturer P/N: ERA-6AEB1272V; Package: 0805
R39 = RES: Thick Film Resistor 86.6k ±1% 0.1W 50V 0402; Manufacturer: Panasonic; Tcr: ±100; Tr: -55:155; Voltage: 50; Power: 0.1; Manufacturer P/N: ERJ-2RKF8662X; Tolerance: ±1%; Alternatives: *; Footprint: *; Package: 0402
R40 = RES: as R59 on sheet reset; Manufacturer P/N: ERA-6AEB103V; Package: 0805
R41 = RES: Thick Film Resistor 143k ±1% 0.1W 50V 0402; Manufacturer: Panasonic; Tcr: ±100; Tr: -55:155; Voltage: 50; Power: 0.1; Manufacturer P/N: ERJ-2RKF1433X; Tolerance: ±1%; Alternatives: *; Footprint: *; Package: 0402
R42 = RES: Thick Film Resistor 100k ±1% 0.1W 50V 0402; Manufacturer: Panasonic; Tcr: ±100; Tr: -55:155; Voltage: 50; Power: 0.1; Manufacturer P/N: ERJ-2RKF1003X; Tolerance: ±1%; Alternatives: *; Footprint: *; Package: 0402
U9 = INA283AIDGK: as U11 on sheet power-v3v3; Manufacturer P/N: INA284AIDGK
U10 = TPS53319DQPR: Synchronous Buck Converter 20A; Manufacturer: Texas Instruments; Manufacturer P/N: TPS53353DQP

## Sheet power-vtt.SchDoc: CS - VTT Power
size Letter; CheckedBy: J. Brinton; CompanyName: Signal Laboratories, Inc.; DrawnBy: J. Brinton; Engineer: J. Brinton; Address1: 3479 Edison Way; Address2: Menlo Park CA 94025; Address3: +1 (877) 778-8435; Address4: siglabs.com; Revision: 3; SheetNumber: 45; SheetTotal: 47
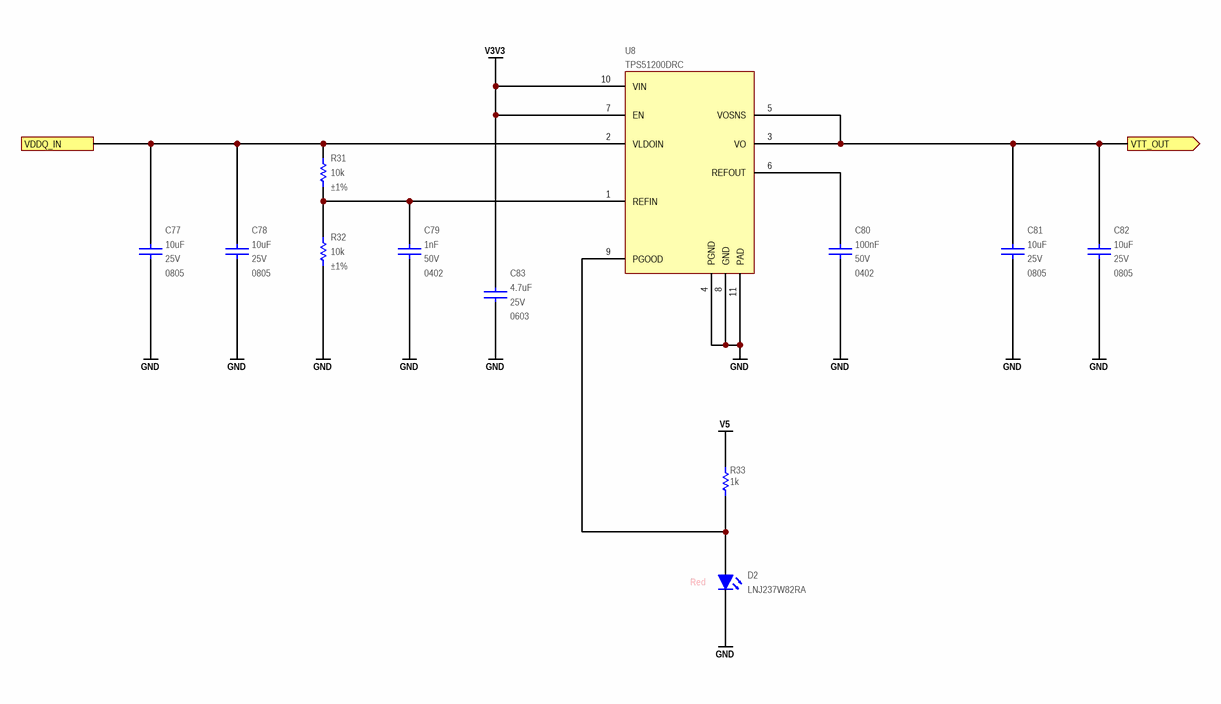
[diagram p25: power-vtt.SchDoc]

### Parts
C77  value 10uF  Voltage: 25V  Package: 0805  [CAPC200X125X145L45N]  (hidden comment: GRM21BC81E106KE51)
C78  value 10uF  Voltage: 25V  Package: 0805  [CAPC200X125X145L45N]  (hidden comment: GRM21BC81E106KE51)
C79  value 1nF  Voltage: 50V  Package: 0402  [CAPC100X50X55L25N]  (hidden comment: GRM155R71H102KA01)
C80  value 100nF  Voltage: 50V  Package: 0402  [CAPC100X50X55L25N]  (hidden comment: GCM155R71H104KE02)
C81  value 10uF  Voltage: 25V  Package: 0805  [CAPC200X125X145L45N]  (hidden comment: GRM21BC81E106KE51)
C82  value 10uF  Voltage: 25V  Package: 0805  [CAPC200X125X145L45N]  (hidden comment: GRM21BC81E106KE51)
C83  value 4.7uF  Voltage: 25V  Package: 0603  [CAPC160X80X90L20N]  (hidden comment: GRM188R61E475KE11)
D2  LNJ237W82RA  [0603_LED]
R31  value 10k  Tolerance: ±1%  [RESC1005X40N]  (hidden comment: ERJ-2RKF1002X)
R32  value 10k  Tolerance: ±1%  [RESC1005X40N]  (hidden comment: ERJ-2RKF1002X)
R33  value 1k  [RESC1005X40N]  (hidden comment: ERJ-2RKF1001X)
U8  TPS51200DRC  [DRC]

### Ports
VDDQ_IN, VTT_OUT (out)

### Nets
GND: C77.1 C78.1 C79.2 C80.1 C81.1 C82.1 C83.1 D2.2(K) R32.2 U8.4(PGND) U8.8(GND) U8.11(PAD)
V1V35: C77.2 C78.2 R31.1 U8.2(VLDOIN) ; port VDDQ_IN
V3V3: C83.2 U8.7(EN) U8.10(VIN)
V5: R33.2
VTTR: C81.2 C82.2 U8.3(VO) U8.5(VOSNS) ; port VTT_OUT
NetC79_1: C79.1 R31.2 R32.1 U8.1(REFIN)
NetC80_2: C80.2 U8.6(REFOUT)
NetD2_1: D2.1(A) R33.1 U8.9(PGOOD)

### Notes on the sheet
- (near D2) Red
- Title
- Engineer
- Revision
- Drawn By
- Checked By
- Date
- Sheet
- of

### Library data of the parts
C77 C78 C81 C82 = CAP: Ceramic Capacitor 10uF ±10% 25V X6S 0805; Manufacturer: Murata; Tr: -55:105; Manufacturer P/N: GRM21BC81E106KE51; Tolerance: ±10%
C79 = CAP: as C87 on sheet power-v1v35; Manufacturer P/N: GRM155R71H102KA01; Tolerance: ±10%
C80 = CAP: as C63-C66 on sheet clock; Manufacturer P/N: GCM155R71H104KE02; Tolerance: ±10%; Footprint: *
C83 = CAP 0603: Ceramic Capacitor 4.7uF ±10% 25V X5R 0603; Manufacturer: Murata; Tr: -55:85; Manufacturer P/N: GRM188R61E475KE11; Tolerance: ±10%
D2 = LED0603RD: as D3 on sheet power-v3v3; Manufacturer P/N: LNJ237W82RA; Package: 0603 Polarized
R31 R32 = RES: Thick Film Resistor 10k ±1% 0.1W 50V 0402; Manufacturer: Panasonic; Tcr: ±100; Tr: -55:155; Voltage: 50; Power: 0.1; Manufacturer P/N: ERJ-2RKF1002X; Alternatives: *; Footprint: *; Package: 0402
R33 = RES: as R46 on sheet power-v3v3; Manufacturer P/N: ERJ-2RKF1001X; Tolerance: ±1%; Alternatives: *; Footprint: *; Package: 0402
U8 = TPS51200: DDR Termination Regulator, 3A Sink and Source; Manufacturer: Texas Instruments; Manufacturer P/N: TPS51200DRC

## Sheet power-v5.SchDoc: CS - Power 5V
size Letter; CheckedBy: J. Brinton; CompanyName: Signal Laboratories, Inc.; DrawnBy: J. Brinton; Engineer: J. Brinton; Address1: 3479 Edison Way; Address2: Menlo Park CA 94025; Address3: +1 (877) 778-8435; Address4: siglabs.com; Revision: 3; SheetNumber: 42; SheetTotal: 47
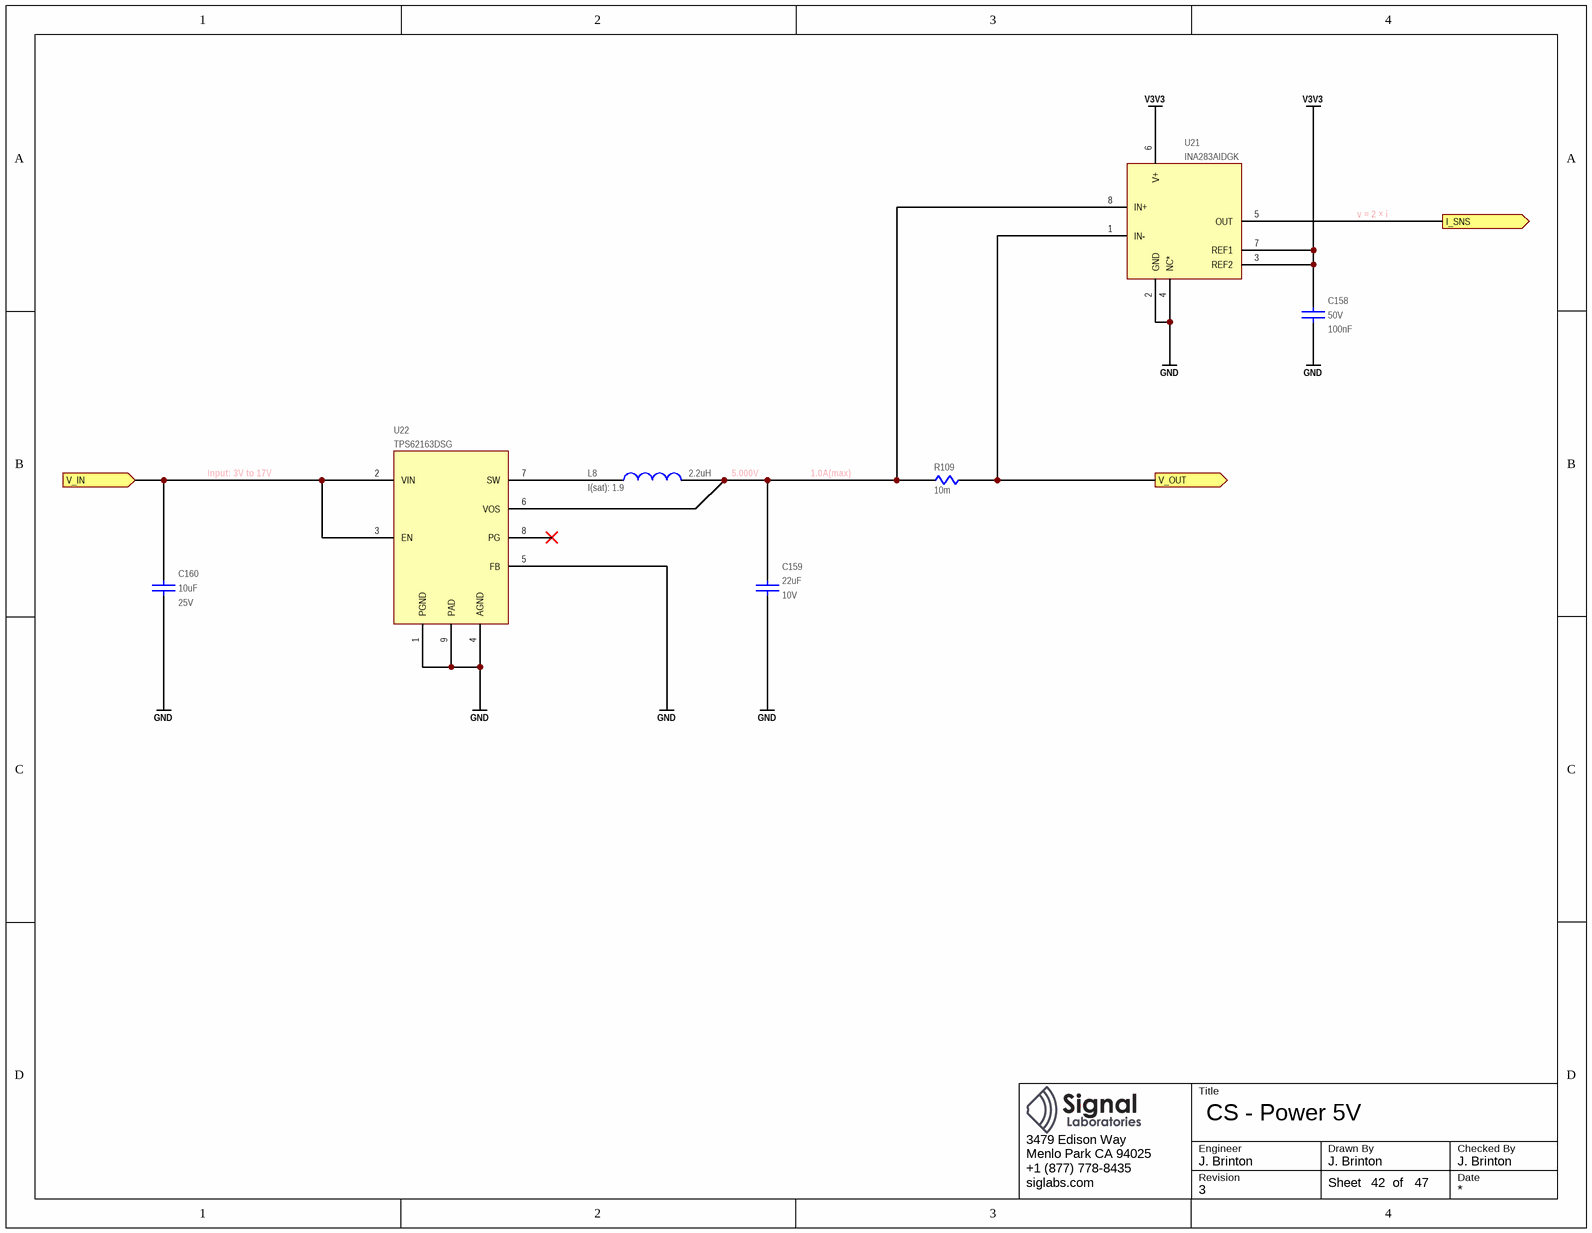
[diagram p26: power-v5.SchDoc]

### Parts
C158  value 100nF  Voltage: 50V  [CAPC100X50X55L25N]  (hidden comment: GCM155R71H104KE02)
C159  value 22uF  Voltage: 10V  [CAPC200X125X145L45N]  (hidden comment: C2012X7S1A226M125)
C160  value 10uF  Voltage: 25V  [CAPC200X125X145L45N]  (hidden comment: GRM21BC81E106KE51)
L8  value 2.2uH  I(sat): 1.9  [ASPI-3010FS]  (hidden comment: ASPI-0310FS-2R2M-T2)
R109  value 10m  [RESC3216X80L110N]  (hidden comment: CSR1206-0R01F1)
U21  INA283AIDGK  [S-PDSO-G8]
U22  TPS62163DSG  [DSG]

### Ports
I_SNS (out), V_IN (in), V_OUT (out)

### Nets
GND: C158.1 C159.1 C160.1 U21.2(GND) U21.4(NC*) U22.1(PGND) U22.4(AGND) U22.5(FB) U22.9(PAD)
V3V3: C158.2 U21.3(REF2) U21.6(V+) U21.7(REF1)
V5: R109.2 U21.1(IN-) ; port V_OUT
V12: C160.2 U22.2(VIN) U22.3(EN) ; port V_IN
I5_SNS: U21.5(OUT) ; port I_SNS
NetC159_2: C159.2 L8.2 R109.1 U21.8(IN+) U22.6(VOS)
NetL8_1: L8.1 U22.7(SW)

Not connected (* = marked no-connect by the designer): U22 8(PG)*

### Notes on the sheet
- v = 2 × i
- Input: 3V to 17V
- (near L8) 5.000V
- 1.0A(max)
- Title
- Engineer
- Revision
- Drawn By
- Checked By
- Date
- Sheet
- of

### Library data of the parts
C158 = CAP: as C63-C66 on sheet clock; Manufacturer P/N: GCM155R71H104KE02; Tolerance: ±10%; Package: 0402
C159 = CAP: as C94 on sheet power-v3v3; Manufacturer P/N: C2012X7S1A226M125; Tolerance: ±20%; Package: 0805
C160 = CAP: as C77 on sheet power-vtt; Manufacturer P/N: GRM21BC81E106KE51; Tolerance: ±10%; Package: 0805
L8 = COIL: Wirewound Inductor 2.2uH +/-20% 1.9A SMD 2518; Manufacturer: Abracon; Manufacturer P/N: ASPI-0310FS-2R2M-T2
R109 = CSR1206-0R001F1: Current Sense Resistor 10mOhm +/-1% SMD 1206; Manufacturer: Riedon; Manufacturer P/N: CSR1206-0R01F1; Package: 1206
U21 = INA283AIDGK: as U11 on sheet power-v3v3; Manufacturer P/N: INA283AIDGK
U22 = TPS62163DSG: 1A Step-Down Converter, 5V; Manufacturer: Texas Instruments; Manufacturer P/N: TPS62163DSG

## Sheet power-v2v5.SchDoc: CS - Power 2.5V
size Letter; CheckedBy: J. Brinton; CompanyName: Signal Laboratories, Inc.; DrawnBy: J. Brinton; Engineer: J. Brinton; Address1: 3479 Edison Way; Address2: Menlo Park CA 94025; Address3: +1 (877) 778-8435; Address4: siglabs.com; Revision: 3; SheetNumber: 43; SheetTotal: 47
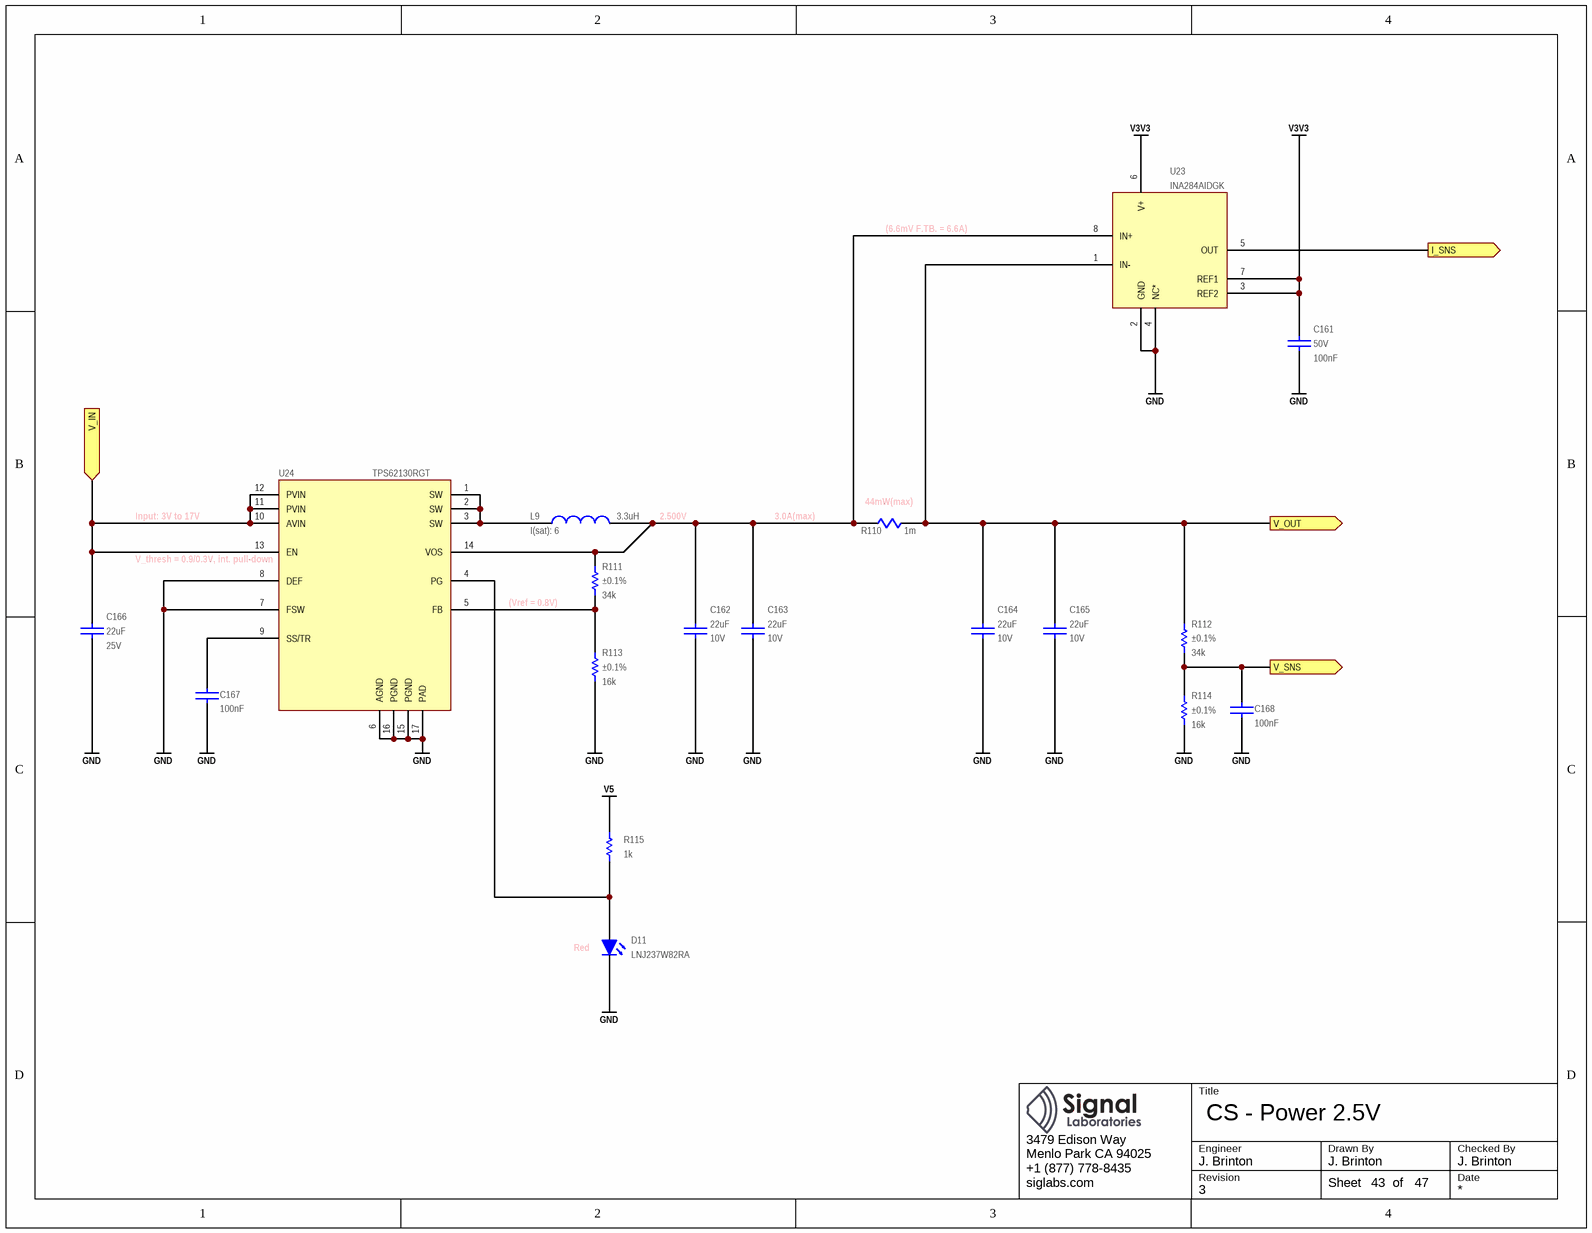
[diagram p27: power-v2v5.SchDoc]

### Parts
C161  value 100nF  Voltage: 50V  [CAPC100X50X55L25N]  (hidden comment: GCM155R71H104KE02)
C162  value 22uF  Voltage: 10V  [CAPC200X125X145L45N]  (hidden comment: C2012X7S1A226M125)
C163  value 22uF  Voltage: 10V  [CAPC200X125X145L45N]  (hidden comment: C2012X7S1A226M125)
C164  value 22uF  Voltage: 10V  [CAPC200X125X145L45N]  (hidden comment: C2012X7S1A226M125)
C165  value 22uF  Voltage: 10V  [CAPC200X125X145L45N]  (hidden comment: C2012X7S1A226M125)
C166  value 22uF  Voltage: 25V  [CAPC320X250X270L50N]  (hidden comment: GRM32ER71E226KE15)
C167  value 100nF  [CAPC100X50X55L25N]  (hidden comment: GCM155R71H104KE02)
C168  value 100nF  [CAPC100X50X55L25N]  (hidden comment: GCM155R71H104KE02)
D11  LNJ237W82RA  [0603_LED]
L9  value 3.3uH  I(sat): 6  [XAL6030]  (hidden comment: XAL6030-332ME)
R110  value 1m  [RESC3216X80L110N]  (hidden comment: CSR1206-0R001F1)
R111  value 34k  Tolerance: ±0.1%  [RESC2012X70N]  (hidden comment: ERA-6AEB3402V)
R112  value 34k  Tolerance: ±0.1%  [RESC2012X70N]  (hidden comment: ERA-6AEB3402V)
R113  value 16k  Tolerance: ±0.1%  [RESC2012X70N]  (hidden comment: ERA-6AEB163V)
R114  value 16k  Tolerance: ±0.1%  [RESC2012X70N]  (hidden comment: ERA-6AEB163V)
R115  value 1k  [RESC1005X40N]  (hidden comment: ERJ-2RKF1001X)
U23  INA284AIDGK  [S-PDSO-G8]
U24  TPS62130RGT  [S-PQFP-8N]

### Ports
I_SNS (out), V_IN (in), V_OUT (out), V_SNS (out)

### Nets
GND: C161.1 C162.1 C163.1 C164.1 C165.1 C166.1 C167.1 C168.1 D11.2(K) R113.1 R114.1 U23.2(GND) U23.4(NC*) U24.6(AGND) U24.7(FSW) U24.8(DEF) U24.15(PGND) U24.16(PGND) U24.17(PAD)
V2V5: C164.2 C165.2 R110.2 R112.2 U23.1(IN-) ; port V_OUT
V3V3: C161.2 U23.3(REF2) U23.6(V+) U23.7(REF1)
V5: R115.2
V12: C166.2 U24.10(AVIN) U24.11(PVIN) U24.12(PVIN) U24.13(EN) ; port V_IN
I2V5_SNS: U23.5(OUT) ; port I_SNS
V2V5_SNS: C168.2 R112.1 R114.2 ; port V_SNS
NetC162_2: C162.2 C163.2 L9.2 R110.1 R111.2 U23.8(IN+) U24.14(VOS)
NetC167_2: C167.2 U24.9(SS/TR)
NetD11_1: D11.1(A) R115.1 U24.4(PG)
NetL9_1: L9.1 U24.1(SW) U24.2(SW) U24.3(SW)
NetR111_1: R111.1 R113.2 U24.5(FB)

### Notes on the sheet
- (6.6mV F.TB. = 6.6A)
- Input: 3V to 17V
- 2.500V
- (near R110) 3.0A(max)
- (near R110) 44mW(max)
- (near U24) V_thresh = 0.9/0.3V, int. pull-down
- (near R111) (Vref = 0.8V)
- (near D11) Red
- Title
- Engineer
- Revision
- Drawn By
- Checked By
- Date
- Sheet
- of

### Library data of the parts
C161 C167 C168 = CAP: as C63-C66 on sheet clock; Manufacturer P/N: GCM155R71H104KE02; Tolerance: ±10%; Package: 0402
  C167 C168: Voltage: 50V; Footprint: *
C162-C165 = CAP: as C94 on sheet power-v3v3; Manufacturer P/N: C2012X7S1A226M125; Tolerance: ±20%; Package: 0805
C166 = CAP: as C96 on sheet power-v3v3; Manufacturer P/N: GRM32ER71E226KE15; Tolerance: ±10%; Package: 1210
D11 = LED0603RD: as D3 on sheet power-v3v3; Manufacturer P/N: LNJ237W82RA; Package: 0603 Polarized
L9 = INDUCTOR: Shielded Power Inductor 3.3uH, 6A; Manufacturer: Coilcraft; Manufacturer P/N: XAL6030-332ME
R110 = CSR1206-0R001F1: Current Sense Resistor 1mOhm +/-1% SMD 1206; Manufacturer: Riedon; Manufacturer P/N: CSR1206-0R001F1; Package: 1206
R111 R112 = RES: Thin Film Resistor 34k ±0.1% 0.125W 100V 0805; Manufacturer: Panasonic; Tcr: ±25; Tr: -55:155; Voltage: 100; Power: 0.125; Manufacturer P/N: ERA-6AEB3402V; Package: 0805
R113 R114 = RES: Thin Film Resistor 16k ±0.1% 0.125W 100V 0805; Manufacturer: Panasonic; Tcr: ±25; Tr: -55:155; Voltage: 100; Power: 0.125; Manufacturer P/N: ERA-6AEB163V; Package: 0805
R115 = RES: as R46 on sheet power-v3v3; Manufacturer P/N: ERJ-2RKF1001X; Tolerance: ±1%; Alternatives: *; Footprint: *; Package: 0402
U23 = INA283AIDGK: as U11 on sheet power-v3v3; Manufacturer P/N: INA284AIDGK
U24 = TPS62130RGT: as U12 on sheet power-v3v3; Manufacturer P/N: TPS62130RGT

## Sheet som.SchDoc
size D; CompanyName: Signal Laboratories, Inc.; Address1: 3479 Edison Way; Address2: Menlo Park CA 94025; Address3: +1 (877) 778-8435; Address4: siglabs.com; Revision: 1; SheetNumber: 1; SheetTotal: 1
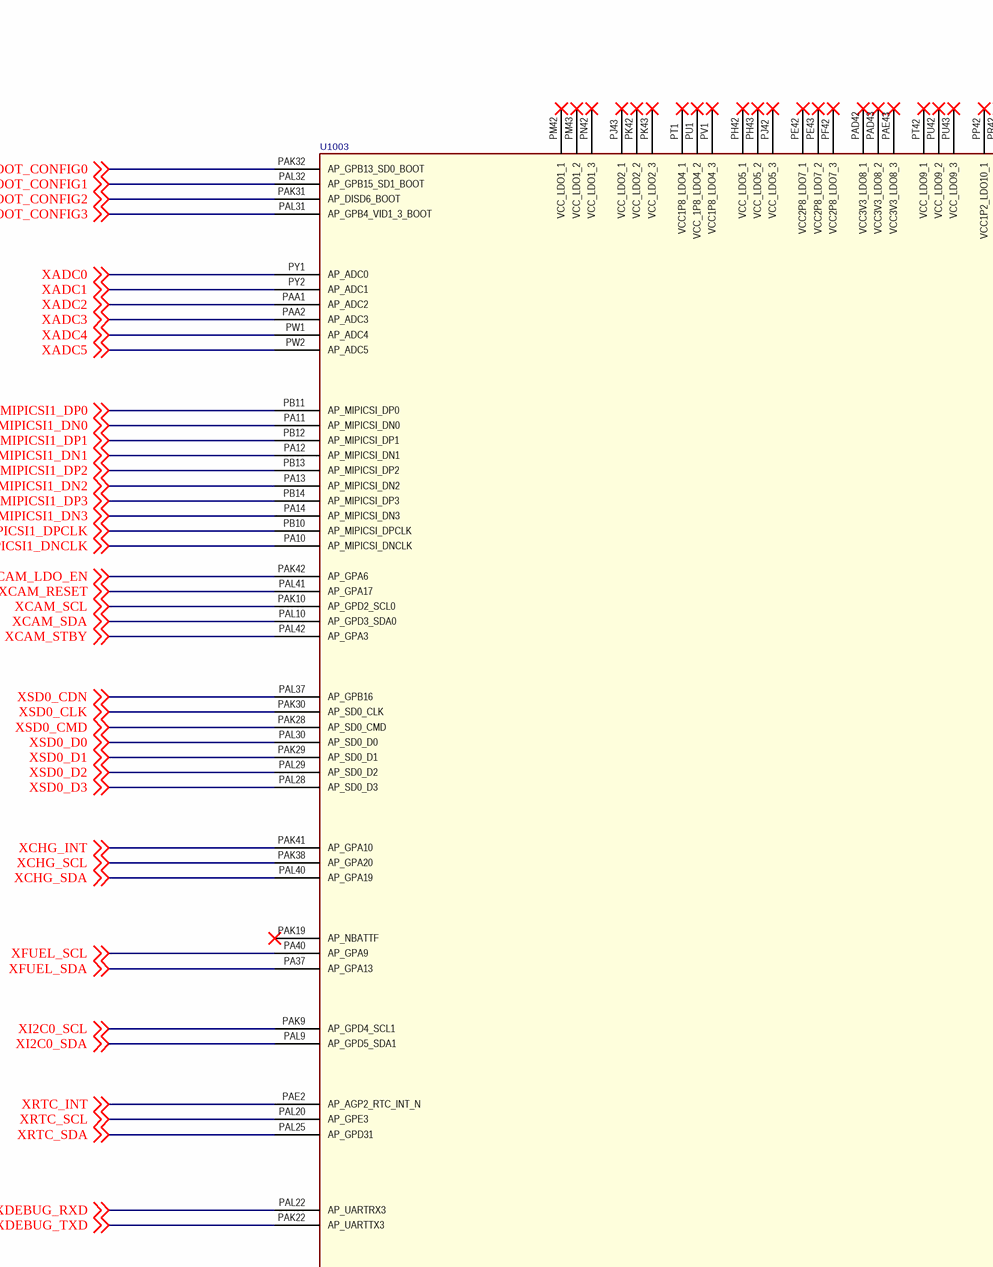
[diagram p28: som.SchDoc, top left]
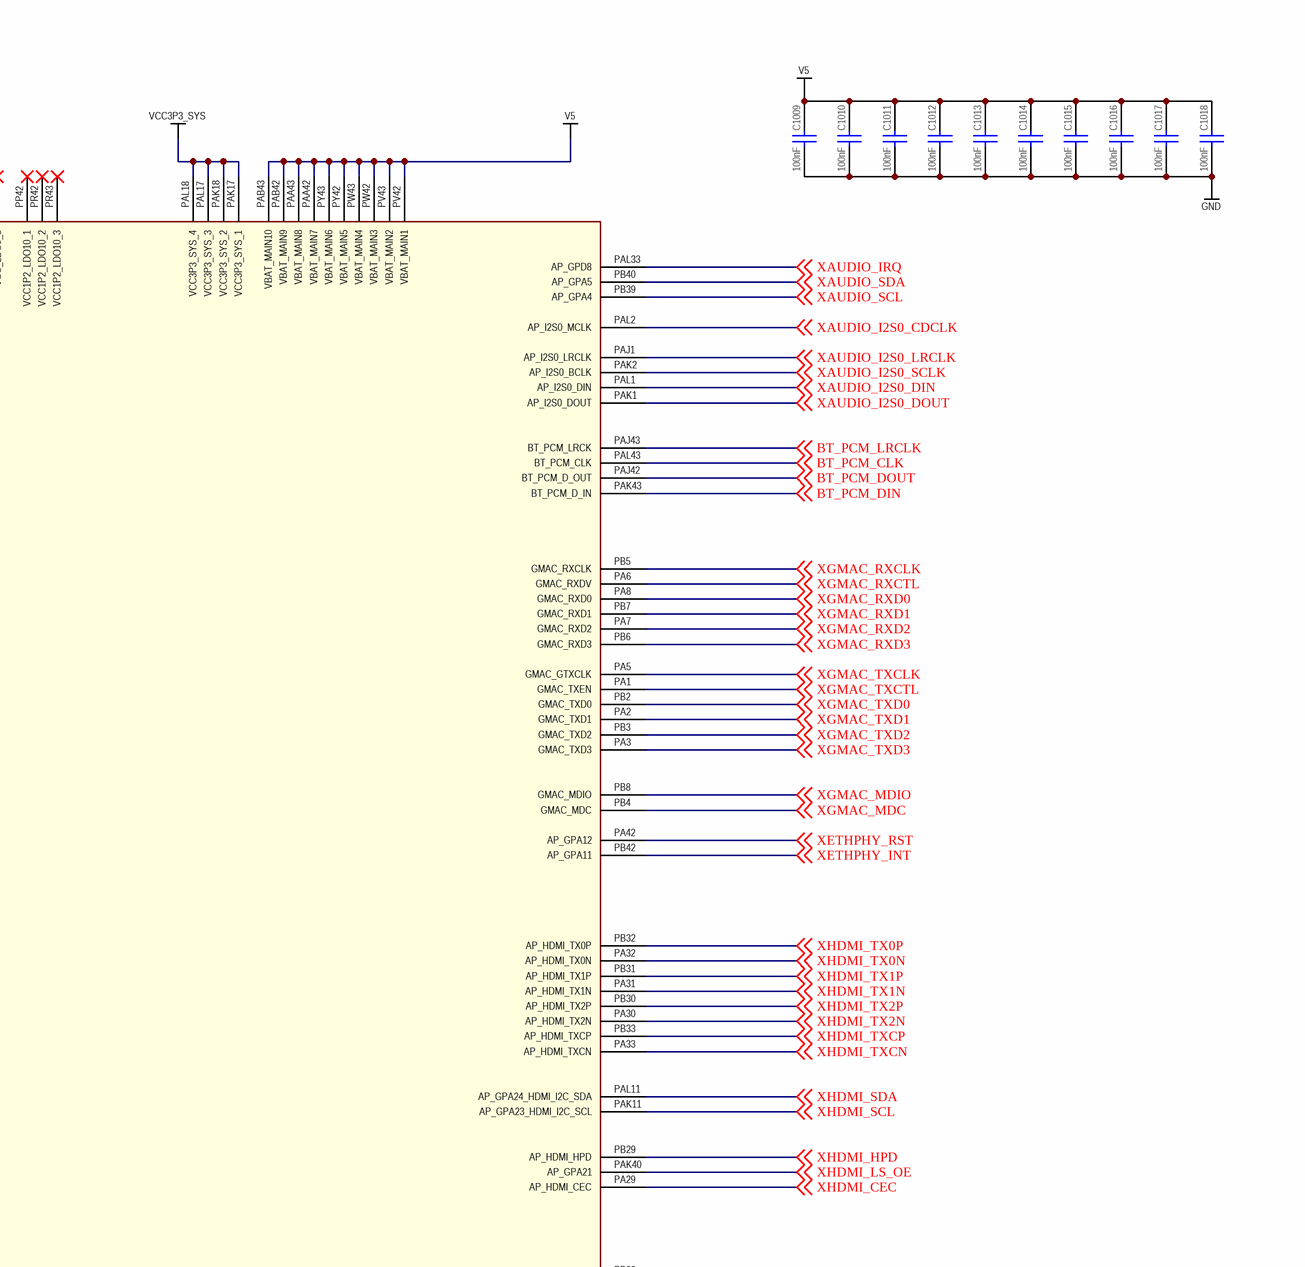
[diagram p29: som.SchDoc, top right]
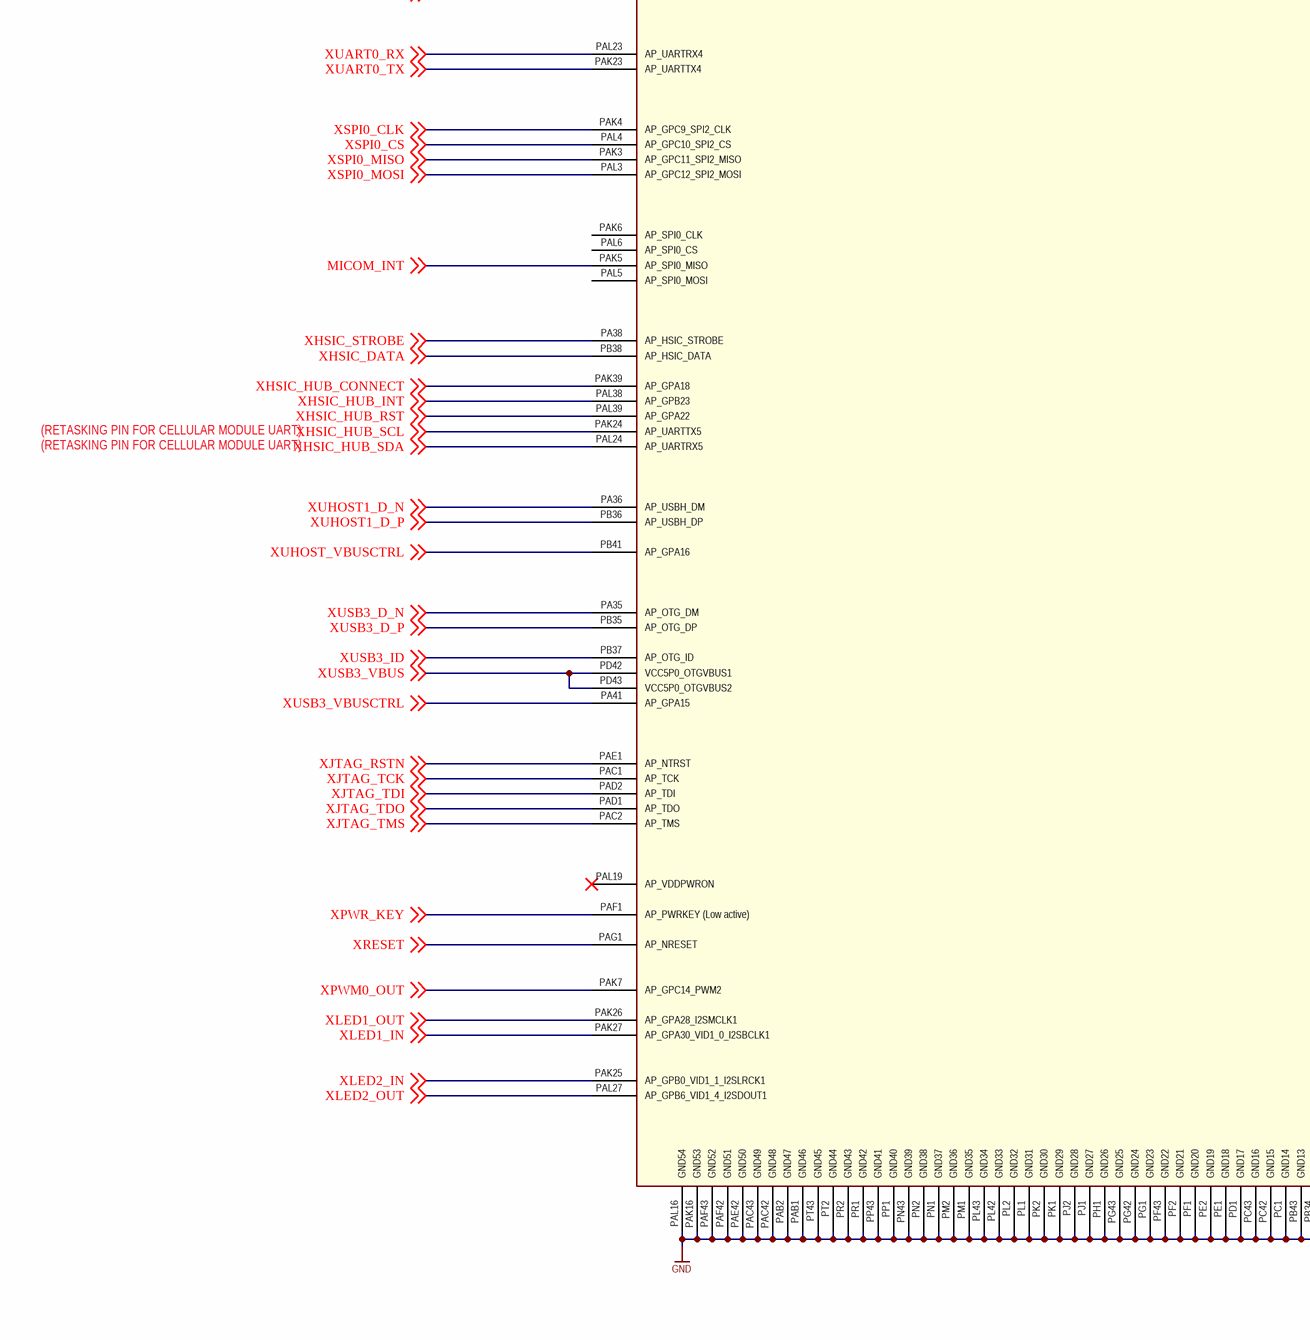
[diagram p30: som.SchDoc, bottom left]
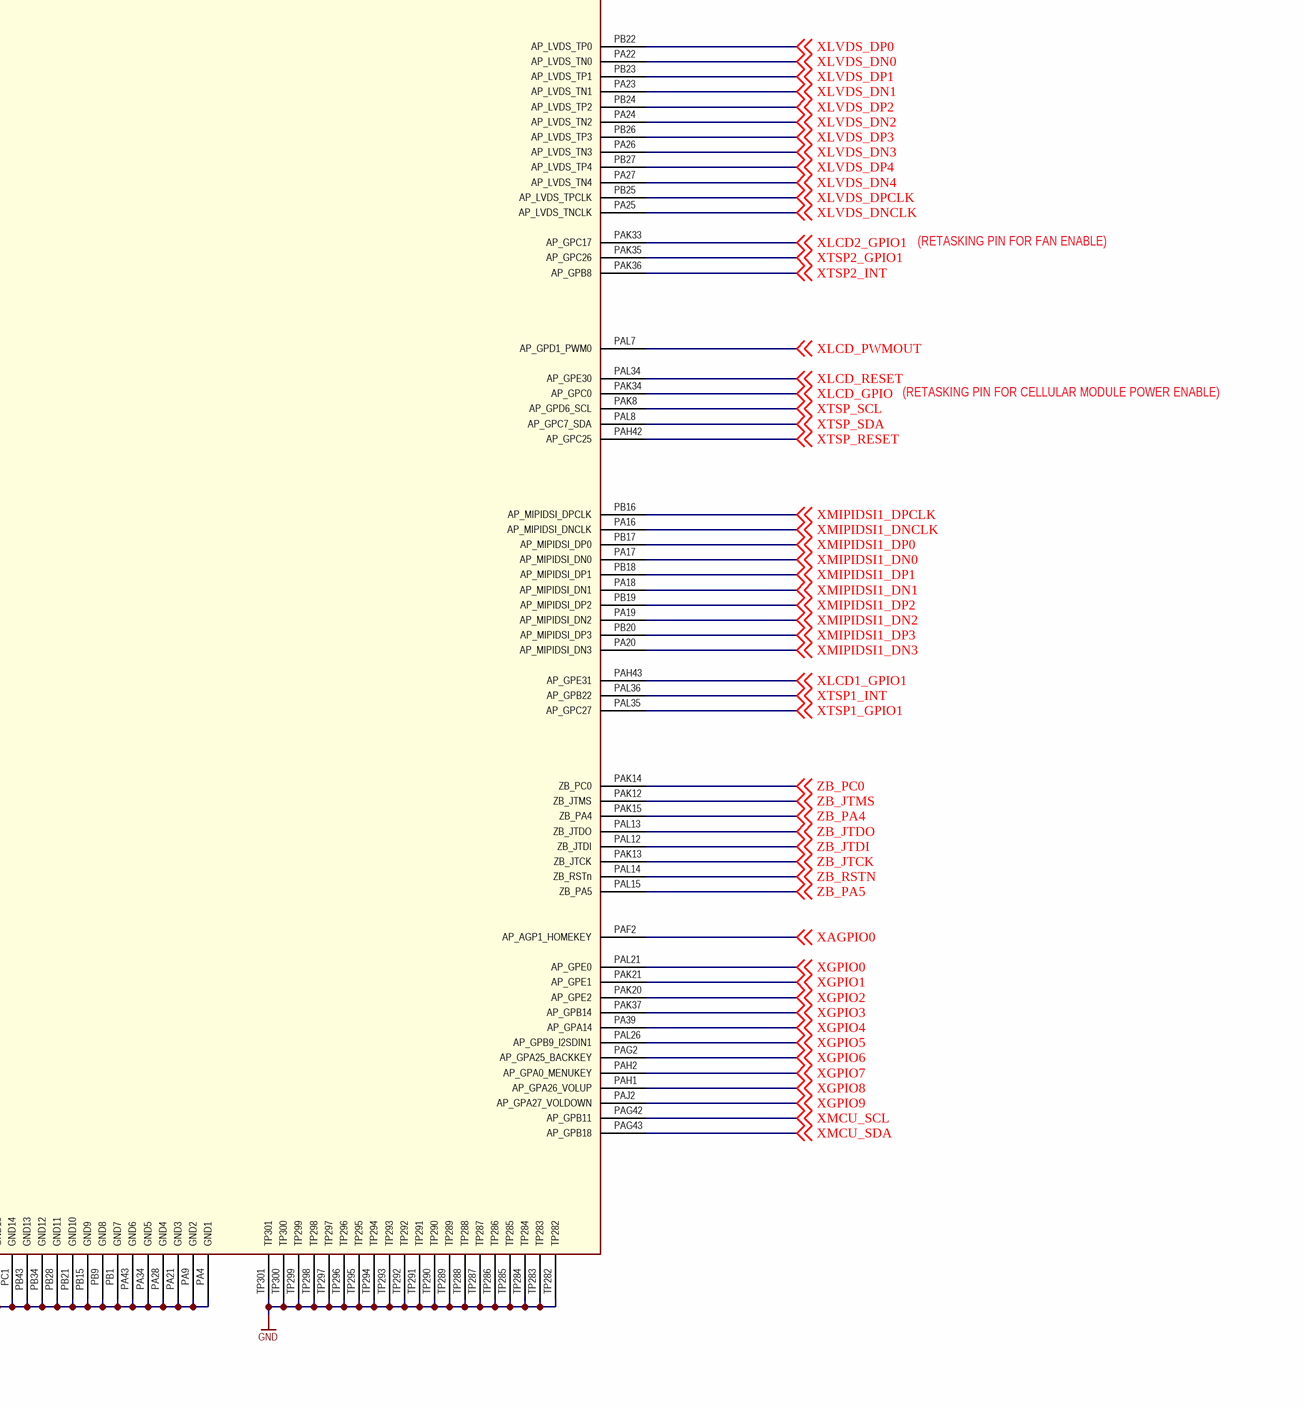
[diagram p31: som.SchDoc, bottom right]

### Parts
C1009  value 100nF  [CAPC100X50X55L25N]  (hidden comment: GCM155R71H104KE02)
C1010  value 100nF  [CAPC100X50X55L25N]  (hidden comment: GCM155R71H104KE02)
C1011  value 100nF  [CAPC100X50X55L25N]  (hidden comment: GCM155R71H104KE02)
C1012  value 100nF  [CAPC100X50X55L25N]  (hidden comment: GCM155R71H104KE02)
C1013  value 100nF  [CAPC100X50X55L25N]  (hidden comment: GCM155R71H104KE02)
C1014  value 100nF  [CAPC100X50X55L25N]  (hidden comment: GCM155R71H104KE02)
C1015  value 100nF  [CAPC100X50X55L25N]  (hidden comment: GCM155R71H104KE02)
C1016  value 100nF  [CAPC100X50X55L25N]  (hidden comment: GCM155R71H104KE02)
C1017  value 100nF  [CAPC100X50X55L25N]  (hidden comment: GCM155R71H104KE02)
C1018  value 100nF  [CAPC100X50X55L25N]  (hidden comment: GCM155R71H104KE02)
U1003  ARTIK_710_LGA_PAD  [ARTIK_LGA_PAD_10]  (value not drawn)

### Nets
GND: C1009.1 C1010.1 C1011.1 C1012.1 C1013.1 C1014.1 C1015.1 C1016.1 C1017.1 C1018.1 U1003.PA4(GND1) U1003.PA9(GND2) U1003.PA21(GND3) U1003.PA28(GND4) U1003.PA34(GND5) U1003.PA43(GND6) U1003.PAB1(GND46) U1003.PAB2(GND47) U1003.PAC42(GND48) U1003.PAC43(GND49) U1003.PAE42(GND50) U1003.PAF42(GND51) U1003.PAF43(GND52) U1003.PAK16(GND53) U1003.PAL16(GND54) U1003.PB1(GND7) U1003.PB9(GND8) U1003.PB15(GND9) U1003.PB21(GND10) U1003.PB28(GND11) U1003.PB34(GND12) U1003.PB43(GND13) U1003.PC1(GND14) U1003.PC42(GND15) U1003.PC43(GND16) U1003.PD1(GND17) U1003.PE1(GND18) U1003.PE2(GND19) U1003.PF1(GND20) U1003.PF2(GND21) U1003.PF43(GND22) U1003.PG1(GND23) U1003.PG42(GND24) U1003.PG43(GND25) U1003.PH1(GND26) U1003.PJ1(GND27) U1003.PJ2(GND28) U1003.PK1(GND29) U1003.PK2(GND30) U1003.PL1(GND31) U1003.PL2(GND32) U1003.PL42(GND33) U1003.PL43(GND34) U1003.PM1(GND35) U1003.PM2(GND36) U1003.PN1(GND37) U1003.PN2(GND38) U1003.PN43(GND39) U1003.PP1(GND40) U1003.PP43(GND41) U1003.PR1(GND42) U1003.PR2(GND43) U1003.PT2(GND44) U1003.PT43(GND45) U1003.TP282 U1003.TP283 U1003.TP284 U1003.TP285 U1003.TP286 U1003.TP287 U1003.TP288 U1003.TP289 U1003.TP290 U1003.TP291 U1003.TP292 U1003.TP293 U1003.TP294 U1003.TP295 U1003.TP296 U1003.TP297 U1003.TP298 U1003.TP299 U1003.TP300 U1003.TP301
V5: C1009.2 C1010.2 C1011.2 C1012.2 C1013.2 C1014.2 C1015.2 C1016.2 C1017.2 C1018.2 U1003.PAA42(VBAT_MAIN7) U1003.PAA43(VBAT_MAIN8) U1003.PAB42(VBAT_MAIN9) U1003.PAB43(VBAT_MAIN10) U1003.PV42(VBAT_MAIN1) U1003.PV43(VBAT_MAIN2) U1003.PW42(VBAT_MAIN3) U1003.PW43(VBAT_MAIN4) U1003.PY42(VBAT_MAIN5) U1003.PY43(VBAT_MAIN6)
VCC3P3_SYS: U1003.PAK17(VCC3P3_SYS_1) U1003.PAK18(VCC3P3_SYS_2) U1003.PAL17(VCC3P3_SYS_3) U1003.PAL18(VCC3P3_SYS_4)
BT_PCM_CLK: U1003.PAL43(BT_PCM_CLK) ; off-sheet BT_PCM_CLK
BT_PCM_DIN: U1003.PAK43(BT_PCM_D_IN) ; off-sheet BT_PCM_DIN
BT_PCM_DOUT: U1003.PAJ42(BT_PCM_D_OUT) ; off-sheet BT_PCM_DOUT
BT_PCM_LRCLK: U1003.PAJ43(BT_PCM_LRCK) ; off-sheet BT_PCM_LRCLK
MICOM_INT: U1003.PAK5(AP_SPI0_MISO) ; off-sheet MICOM_INT
XADC0: U1003.PY1(AP_ADC0) ; off-sheet XADC0
XADC1: U1003.PY2(AP_ADC1) ; off-sheet XADC1
XADC2: U1003.PAA1(AP_ADC2) ; off-sheet XADC2
XADC3: U1003.PAA2(AP_ADC3) ; off-sheet XADC3
XADC4: U1003.PW1(AP_ADC4) ; off-sheet XADC4
XADC5: U1003.PW2(AP_ADC5) ; off-sheet XADC5
XAGPIO0: U1003.PAF2(AP_AGP1_HOMEKEY) ; off-sheet XAGPIO0
XAUDIO_I2S0_CDCLK: U1003.PAL2(AP_I2S0_MCLK) ; off-sheet XAUDIO_I2S0_CDCLK
XAUDIO_I2S0_DIN: U1003.PAL1(AP_I2S0_DIN) ; off-sheet XAUDIO_I2S0_DIN
XAUDIO_I2S0_DOUT: U1003.PAK1(AP_I2S0_DOUT) ; off-sheet XAUDIO_I2S0_DOUT
XAUDIO_I2S0_LRCLK: U1003.PAJ1(AP_I2S0_LRCLK) ; off-sheet XAUDIO_I2S0_LRCLK
XAUDIO_I2S0_SCLK: U1003.PAK2(AP_I2S0_BCLK) ; off-sheet XAUDIO_I2S0_SCLK
XAUDIO_IRQ: U1003.PAL33(AP_GPD8) ; off-sheet XAUDIO_IRQ
XAUDIO_SCL: U1003.PB39(AP_GPA4) ; off-sheet XAUDIO_SCL
XAUDIO_SDA: U1003.PB40(AP_GPA5) ; off-sheet XAUDIO_SDA
XBOOT_CONFIG0: U1003.PAK32(AP_GPB13_SD0_BOOT) ; off-sheet XBOOT_CONFIG0
XBOOT_CONFIG1: U1003.PAL32(AP_GPB15_SD1_BOOT) ; off-sheet XBOOT_CONFIG1
XBOOT_CONFIG2: U1003.PAK31(AP_DISD6_BOOT) ; off-sheet XBOOT_CONFIG2
XBOOT_CONFIG3: U1003.PAL31(AP_GPB4_VID1_3_BOOT) ; off-sheet XBOOT_CONFIG3
XCAM_LDO_EN: U1003.PAK42(AP_GPA6) ; off-sheet XCAM_LDO_EN
XCAM_RESET: U1003.PAL41(AP_GPA17) ; off-sheet XCAM_RESET
XCAM_SCL: U1003.PAK10(AP_GPD2_SCL0) ; off-sheet XCAM_SCL
XCAM_SDA: U1003.PAL10(AP_GPD3_SDA0) ; off-sheet XCAM_SDA
XCAM_STBY: U1003.PAL42(AP_GPA3) ; off-sheet XCAM_STBY
XCHG_INT: U1003.PAK41(AP_GPA10) ; off-sheet XCHG_INT
XCHG_SCL: U1003.PAK38(AP_GPA20) ; off-sheet XCHG_SCL
XCHG_SDA: U1003.PAL40(AP_GPA19) ; off-sheet XCHG_SDA
XDEBUG_RXD: U1003.PAL22(AP_UARTRX3) ; off-sheet XDEBUG_RXD
XDEBUG_TXD: U1003.PAK22(AP_UARTTX3) ; off-sheet XDEBUG_TXD
XETHPHY_INT: U1003.PB42(AP_GPA11) ; off-sheet XETHPHY_INT
XETHPHY_RST: U1003.PA42(AP_GPA12) ; off-sheet XETHPHY_RST
XFUEL_SCL: U1003.PA40(AP_GPA9) ; off-sheet XFUEL_SCL
XFUEL_SDA: U1003.PA37(AP_GPA13) ; off-sheet XFUEL_SDA
XGMAC_MDC: U1003.PB4(GMAC_MDC) ; off-sheet XGMAC_MDC
XGMAC_MDIO: U1003.PB8(GMAC_MDIO) ; off-sheet XGMAC_MDIO
XGMAC_RXCLK: U1003.PB5(GMAC_RXCLK) ; off-sheet XGMAC_RXCLK
XGMAC_RXCTL: U1003.PA6(GMAC_RXDV) ; off-sheet XGMAC_RXCTL
XGMAC_RXD0: U1003.PA8(GMAC_RXD0) ; off-sheet XGMAC_RXD0
XGMAC_RXD1: U1003.PB7(GMAC_RXD1) ; off-sheet XGMAC_RXD1
XGMAC_RXD2: U1003.PA7(GMAC_RXD2) ; off-sheet XGMAC_RXD2
XGMAC_RXD3: U1003.PB6(GMAC_RXD3) ; off-sheet XGMAC_RXD3
XGMAC_TXCLK: U1003.PA5(GMAC_GTXCLK) ; off-sheet XGMAC_TXCLK
XGMAC_TXCTL: U1003.PA1(GMAC_TXEN) ; off-sheet XGMAC_TXCTL
XGMAC_TXD0: U1003.PB2(GMAC_TXD0) ; off-sheet XGMAC_TXD0
XGMAC_TXD1: U1003.PA2(GMAC_TXD1) ; off-sheet XGMAC_TXD1
XGMAC_TXD2: U1003.PB3(GMAC_TXD2) ; off-sheet XGMAC_TXD2
XGMAC_TXD3: U1003.PA3(GMAC_TXD3) ; off-sheet XGMAC_TXD3
XGPIO0: U1003.PAL21(AP_GPE0) ; off-sheet XGPIO0
XGPIO1: U1003.PAK21(AP_GPE1) ; off-sheet XGPIO1
XGPIO2: U1003.PAK20(AP_GPE2) ; off-sheet XGPIO2
XGPIO3: U1003.PAK37(AP_GPB14) ; off-sheet XGPIO3
XGPIO4: U1003.PA39(AP_GPA14) ; off-sheet XGPIO4
XGPIO5: U1003.PAL26(AP_GPB9_I2SDIN1) ; off-sheet XGPIO5
XGPIO6: U1003.PAG2(AP_GPA25_BACKKEY) ; off-sheet XGPIO6
XGPIO7: U1003.PAH2(AP_GPA0_MENUKEY) ; off-sheet XGPIO7
XGPIO8: U1003.PAH1(AP_GPA26_VOLUP) ; off-sheet XGPIO8
XGPIO9: U1003.PAJ2(AP_GPA27_VOLDOWN) ; off-sheet XGPIO9
XHDMI_CEC: U1003.PA29(AP_HDMI_CEC) ; off-sheet XHDMI_CEC
XHDMI_HPD: U1003.PB29(AP_HDMI_HPD) ; off-sheet XHDMI_HPD
XHDMI_LS_OE: U1003.PAK40(AP_GPA21) ; off-sheet XHDMI_LS_OE
XHDMI_SCL: U1003.PAK11(AP_GPA23_HDMI_I2C_SCL) ; off-sheet XHDMI_SCL
XHDMI_SDA: U1003.PAL11(AP_GPA24_HDMI_I2C_SDA) ; off-sheet XHDMI_SDA
XHDMI_TX0N: U1003.PA32(AP_HDMI_TX0N) ; off-sheet XHDMI_TX0N
XHDMI_TX0P: U1003.PB32(AP_HDMI_TX0P) ; off-sheet XHDMI_TX0P
XHDMI_TX1N: U1003.PA31(AP_HDMI_TX1N) ; off-sheet XHDMI_TX1N
XHDMI_TX1P: U1003.PB31(AP_HDMI_TX1P) ; off-sheet XHDMI_TX1P
XHDMI_TX2N: U1003.PA30(AP_HDMI_TX2N) ; off-sheet XHDMI_TX2N
XHDMI_TX2P: U1003.PB30(AP_HDMI_TX2P) ; off-sheet XHDMI_TX2P
XHDMI_TXCN: U1003.PA33(AP_HDMI_TXCN) ; off-sheet XHDMI_TXCN
XHDMI_TXCP: U1003.PB33(AP_HDMI_TXCP) ; off-sheet XHDMI_TXCP
XHSIC_DATA: U1003.PB38(AP_HSIC_DATA) ; off-sheet XHSIC_DATA
XHSIC_HUB_CONNECT: U1003.PAK39(AP_GPA18) ; off-sheet XHSIC_HUB_CONNECT
XHSIC_HUB_INT: U1003.PAL38(AP_GPB23) ; off-sheet XHSIC_HUB_INT
XHSIC_HUB_RST: U1003.PAL39(AP_GPA22) ; off-sheet XHSIC_HUB_RST
XHSIC_HUB_SCL: U1003.PAK24(AP_UARTTX5) ; off-sheet XHSIC_HUB_SCL
XHSIC_HUB_SDA: U1003.PAL24(AP_UARTRX5) ; off-sheet XHSIC_HUB_SDA
XHSIC_STROBE: U1003.PA38(AP_HSIC_STROBE) ; off-sheet XHSIC_STROBE
XI2C0_SCL: U1003.PAK9(AP_GPD4_SCL1) ; off-sheet XI2C0_SCL
XI2C0_SDA: U1003.PAL9(AP_GPD5_SDA1) ; off-sheet XI2C0_SDA
XJTAG_RSTN: U1003.PAE1(AP_NTRST) ; off-sheet XJTAG_RSTN
XJTAG_TCK: U1003.PAC1(AP_TCK) ; off-sheet XJTAG_TCK
XJTAG_TDI: U1003.PAD2(AP_TDI) ; off-sheet XJTAG_TDI
XJTAG_TDO: U1003.PAD1(AP_TDO) ; off-sheet XJTAG_TDO
XJTAG_TMS: U1003.PAC2(AP_TMS) ; off-sheet XJTAG_TMS
XLCD1_GPIO1: U1003.PAH43(AP_GPE31) ; off-sheet XLCD1_GPIO1
XLCD2_GPIO1: U1003.PAK33(AP_GPC17) ; off-sheet XLCD2_GPIO1
XLCD_GPIO: U1003.PAK34(AP_GPC0) ; off-sheet XLCD_GPIO
XLCD_PWMOUT: U1003.PAL7(AP_GPD1_PWM0) ; off-sheet XLCD_PWMOUT
XLCD_RESET: U1003.PAL34(AP_GPE30) ; off-sheet XLCD_RESET
XLED1_IN: U1003.PAK27(AP_GPA30_VID1_0_I2SBCLK1) ; off-sheet XLED1_IN
XLED1_OUT: U1003.PAK26(AP_GPA28_I2SMCLK1) ; off-sheet XLED1_OUT
XLED2_IN: U1003.PAK25(AP_GPB0_VID1_1_I2SLRCK1) ; off-sheet XLED2_IN
XLED2_OUT: U1003.PAL27(AP_GPB6_VID1_4_I2SDOUT1) ; off-sheet XLED2_OUT
XLVDS_DN0: U1003.PA22(AP_LVDS_TN0) ; off-sheet XLVDS_DN0
XLVDS_DN1: U1003.PA23(AP_LVDS_TN1) ; off-sheet XLVDS_DN1
XLVDS_DN2: U1003.PA24(AP_LVDS_TN2) ; off-sheet XLVDS_DN2
XLVDS_DN3: U1003.PA26(AP_LVDS_TN3) ; off-sheet XLVDS_DN3
XLVDS_DN4: U1003.PA27(AP_LVDS_TN4) ; off-sheet XLVDS_DN4
XLVDS_DNCLK: U1003.PA25(AP_LVDS_TNCLK) ; off-sheet XLVDS_DNCLK
XLVDS_DP0: U1003.PB22(AP_LVDS_TP0) ; off-sheet XLVDS_DP0
XLVDS_DP1: U1003.PB23(AP_LVDS_TP1) ; off-sheet XLVDS_DP1
XLVDS_DP2: U1003.PB24(AP_LVDS_TP2) ; off-sheet XLVDS_DP2
XLVDS_DP3: U1003.PB26(AP_LVDS_TP3) ; off-sheet XLVDS_DP3
XLVDS_DP4: U1003.PB27(AP_LVDS_TP4) ; off-sheet XLVDS_DP4
XLVDS_DPCLK: U1003.PB25(AP_LVDS_TPCLK) ; off-sheet XLVDS_DPCLK
XMCU_SCL: U1003.PAG42(AP_GPB11) ; off-sheet XMCU_SCL
XMCU_SDA: U1003.PAG43(AP_GPB18) ; off-sheet XMCU_SDA
XMIPICSI1_DN0: U1003.PA11(AP_MIPICSI_DN0) ; off-sheet XMIPICSI1_DN0
XMIPICSI1_DN1: U1003.PA12(AP_MIPICSI_DN1) ; off-sheet XMIPICSI1_DN1
XMIPICSI1_DN2: U1003.PA13(AP_MIPICSI_DN2) ; off-sheet XMIPICSI1_DN2
XMIPICSI1_DN3: U1003.PA14(AP_MIPICSI_DN3) ; off-sheet XMIPICSI1_DN3
XMIPICSI1_DNCLK: U1003.PA10(AP_MIPICSI_DNCLK) ; off-sheet XMIPICSI1_DNCLK
XMIPICSI1_DP0: U1003.PB11(AP_MIPICSI_DP0) ; off-sheet XMIPICSI1_DP0
XMIPICSI1_DP1: U1003.PB12(AP_MIPICSI_DP1) ; off-sheet XMIPICSI1_DP1
XMIPICSI1_DP2: U1003.PB13(AP_MIPICSI_DP2) ; off-sheet XMIPICSI1_DP2
XMIPICSI1_DP3: U1003.PB14(AP_MIPICSI_DP3) ; off-sheet XMIPICSI1_DP3
XMIPICSI1_DPCLK: U1003.PB10(AP_MIPICSI_DPCLK) ; off-sheet XMIPICSI1_DPCLK
XMIPIDSI1_DN0: U1003.PA17(AP_MIPIDSI_DN0) ; off-sheet XMIPIDSI1_DN0
XMIPIDSI1_DN1: U1003.PA18(AP_MIPIDSI_DN1) ; off-sheet XMIPIDSI1_DN1
XMIPIDSI1_DN2: U1003.PA19(AP_MIPIDSI_DN2) ; off-sheet XMIPIDSI1_DN2
XMIPIDSI1_DN3: U1003.PA20(AP_MIPIDSI_DN3) ; off-sheet XMIPIDSI1_DN3
XMIPIDSI1_DNCLK: U1003.PA16(AP_MIPIDSI_DNCLK) ; off-sheet XMIPIDSI1_DNCLK
XMIPIDSI1_DP0: U1003.PB17(AP_MIPIDSI_DP0) ; off-sheet XMIPIDSI1_DP0
XMIPIDSI1_DP1: U1003.PB18(AP_MIPIDSI_DP1) ; off-sheet XMIPIDSI1_DP1
XMIPIDSI1_DP2: U1003.PB19(AP_MIPIDSI_DP2) ; off-sheet XMIPIDSI1_DP2
XMIPIDSI1_DP3: U1003.PB20(AP_MIPIDSI_DP3) ; off-sheet XMIPIDSI1_DP3
XMIPIDSI1_DPCLK: U1003.PB16(AP_MIPIDSI_DPCLK) ; off-sheet XMIPIDSI1_DPCLK
XPWM0_OUT: U1003.PAK7(AP_GPC14_PWM2) ; off-sheet XPWM0_OUT
XPWR_KEY: U1003.PAF1(AP_PWRKEY_(Low_active)) ; off-sheet XPWR_KEY
XRESET: U1003.PAG1(AP_NRESET) ; off-sheet XRESET
XRTC_INT: U1003.PAE2(AP_AGP2_RTC_INT_N) ; off-sheet XRTC_INT
XRTC_SCL: U1003.PAL20(AP_GPE3) ; off-sheet XRTC_SCL
XRTC_SDA: U1003.PAL25(AP_GPD31) ; off-sheet XRTC_SDA
XSD0_CDN: U1003.PAL37(AP_GPB16) ; off-sheet XSD0_CDN
XSD0_CLK: U1003.PAK30(AP_SD0_CLK) ; off-sheet XSD0_CLK
XSD0_CMD: U1003.PAK28(AP_SD0_CMD) ; off-sheet XSD0_CMD
XSD0_D0: U1003.PAL30(AP_SD0_D0) ; off-sheet XSD0_D0
XSD0_D1: U1003.PAK29(AP_SD0_D1) ; off-sheet XSD0_D1
XSD0_D2: U1003.PAL29(AP_SD0_D2) ; off-sheet XSD0_D2
XSD0_D3: U1003.PAL28(AP_SD0_D3) ; off-sheet XSD0_D3
XSPI0_CLK: U1003.PAK4(AP_GPC9_SPI2_CLK) ; off-sheet XSPI0_CLK
XSPI0_CS: U1003.PAL4(AP_GPC10_SPI2_CS) ; off-sheet XSPI0_CS
XSPI0_MISO: U1003.PAK3(AP_GPC11_SPI2_MISO) ; off-sheet XSPI0_MISO
XSPI0_MOSI: U1003.PAL3(AP_GPC12_SPI2_MOSI) ; off-sheet XSPI0_MOSI
XTSP1_GPIO1: U1003.PAL35(AP_GPC27) ; off-sheet XTSP1_GPIO1
XTSP1_INT: U1003.PAL36(AP_GPB22) ; off-sheet XTSP1_INT
XTSP2_GPIO1: U1003.PAK35(AP_GPC26) ; off-sheet XTSP2_GPIO1
XTSP2_INT: U1003.PAK36(AP_GPB8) ; off-sheet XTSP2_INT
XTSP_RESET: U1003.PAH42(AP_GPC25) ; off-sheet XTSP_RESET
XTSP_SCL: U1003.PAK8(AP_GPD6_SCL) ; off-sheet XTSP_SCL
XTSP_SDA: U1003.PAL8(AP_GPC7_SDA) ; off-sheet XTSP_SDA
XUART0_RX: U1003.PAL23(AP_UARTRX4) ; off-sheet XUART0_RX
XUART0_TX: U1003.PAK23(AP_UARTTX4) ; off-sheet XUART0_TX
XUHOST1_D_N: U1003.PA36(AP_USBH_DM) ; off-sheet XUHOST1_D_N
XUHOST1_D_P: U1003.PB36(AP_USBH_DP) ; off-sheet XUHOST1_D_P
XUHOST_VBUSCTRL: U1003.PB41(AP_GPA16) ; off-sheet XUHOST_VBUSCTRL
XUSB3_D_N: U1003.PA35(AP_OTG_DM) ; off-sheet XUSB3_D_N
XUSB3_D_P: U1003.PB35(AP_OTG_DP) ; off-sheet XUSB3_D_P
XUSB3_ID: U1003.PB37(AP_OTG_ID) ; off-sheet XUSB3_ID
XUSB3_VBUS: U1003.PD42(VCC5P0_OTGVBUS1) U1003.PD43(VCC5P0_OTGVBUS2) ; off-sheet XUSB3_VBUS
XUSB3_VBUSCTRL: U1003.PA41(AP_GPA15) ; off-sheet XUSB3_VBUSCTRL
ZB_JTCK: U1003.PAK13(ZB_JTCK) ; off-sheet ZB_JTCK
ZB_JTDI: U1003.PAL12(ZB_JTDI) ; off-sheet ZB_JTDI
ZB_JTDO: U1003.PAL13(ZB_JTDO) ; off-sheet ZB_JTDO
ZB_JTMS: U1003.PAK12(ZB_JTMS) ; off-sheet ZB_JTMS
ZB_PA4: U1003.PAK15(ZB_PA4) ; off-sheet ZB_PA4
ZB_PA5: U1003.PAL15(ZB_PA5) ; off-sheet ZB_PA5
ZB_PC0: U1003.PAK14(ZB_PC0) ; off-sheet ZB_PC0
ZB_RSTN: U1003.PAL14(ZB_RSTn) ; off-sheet ZB_RSTN

Not connected (* = marked no-connect by the designer): U1003 PAD42(VCC3V3_LDO8_1)* PAD43(VCC3V3_LDO8_2)* PAE43(VCC3V3_LDO8_3)* PAK6(AP_SPI0_CLK) PAK19(AP_NBATTF)* PAL5(AP_SPI0_MOSI) PAL6(AP_SPI0_CS) PAL19(AP_VDDPWRON)* PE42(VCC2P8_LDO7_1)* PE43(VCC2P8_LDO7_2)* PF42(VCC2P8_LDO7_3)* PH42(VCC_LDO5_1)* PH43(VCC_LDO5_2)* PJ42(VCC_LDO5_3)* PJ43(VCC_LDO2_1)* PK42(VCC_LDO2_2)* PK43(VCC_LDO2_3)* PM42(VCC_LDO1_1)* PM43(VCC_LDO1_2)* PN42(VCC_LDO1_3)* PP42(VCC1P2_LDO10_1)* PR42(VCC1P2_LDO10_2)* PR43(VCC1P2_LDO10_3)* PT1(VCC1P8_LDO4_1)* PT42(VCC_LDO9_1)* PU1(VCC_1P8_LDO4_2)* PU42(VCC_LDO9_2)* PU43(VCC_LDO9_3)* PV1(VCC1P8_LDO4_3)*

### Notes on the sheet
- (RETASKING PIN FOR FAN ENABLE)
- (RETASKING PIN FOR CELLULAR MODULE POWER ENABLE)
- (RETASKING PIN FOR CELLULAR MODULE UART)
- Title
- Engineer
- Revision
- Drawn By
- Sheet
- of
- Checked By
- Date

### Library data of the parts
C1009-C1018 = CAP: as C63-C66 on sheet clock; Manufacturer P/N: GCM155R71H104KE02; Tolerance: ±10%; Voltage: 50V; Footprint: *; Package: 0402
U1003 = ARTIK_LGA_PAD_10: ARTIK 710 System on Module; Manufacturer: Samsung; Manufacturer P/N: Artik 710